# EAGLE design Rapid_Prototype_Schematicv2 (EAGLE 9.6.2)

## Sheet 1 of 4
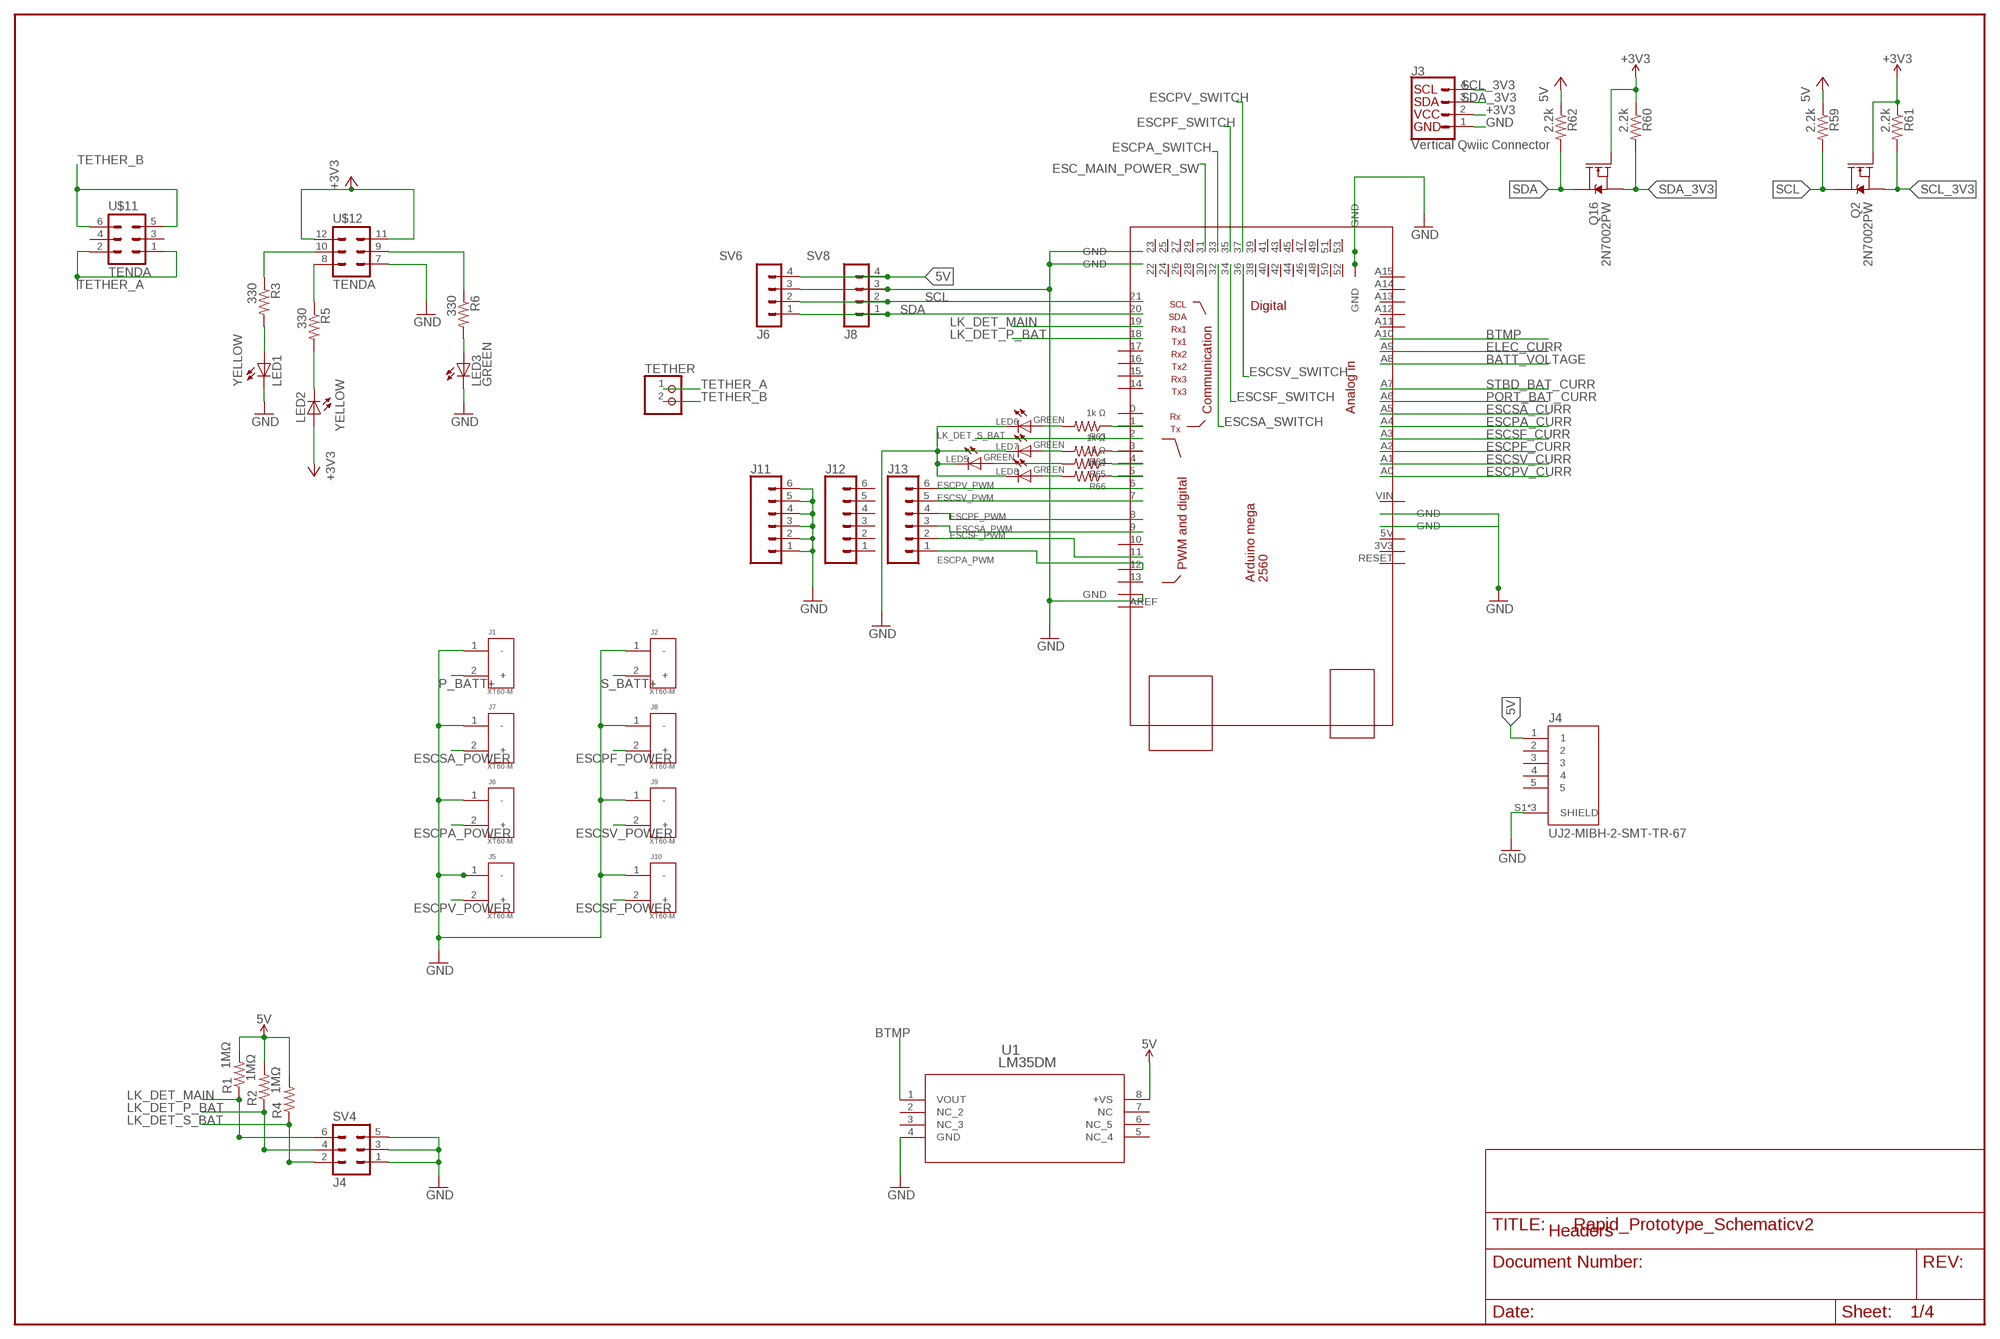
[diagram p0: schematic, sheet 1]

### Parts
$2_3_$_2020-06-04_21-52-10  MEGA_DEVICE  [MEGAOUTLINE]
J1  XT60-M  [AMASS_XT60-M]
J2  XT60-M  [AMASS_XT60-M]
J3  Vertical Qwiic Connector  QWIIC_CONNECTOR  [JST04_1MM_VERT]
J4  UJ2-MIBH-2-SMT-TR-67  [CUI_UJ2-MIBH-2-SMT-TR-67]
J5  XT60-M  [AMASS_XT60-M]
J6  XT60-M  [AMASS_XT60-M]
J7  XT60-M  [AMASS_XT60-M]
J8  XT60-M  [AMASS_XT60-M]
J9  XT60-M  [AMASS_XT60-M]
J10  XT60-M  [AMASS_XT60-M]
J11  CONN_06SILK_FEMALE_PTH  [1X06]
J12  CONN_06SILK_FEMALE_PTH  [1X06]
J13  CONN_06SILK_FEMALE_PTH  [1X06]
LED1  YELLOW  LEDCHIPLED_0805  [CHIPLED_0805]
LED2  YELLOW  LEDCHIPLED_0805  [CHIPLED_0805]
LED3  GREEN  LEDCHIPLED_0805  [CHIPLED_0805]
LED5  GREEN  LEDCHIPLED_0805  [CHIPLED_0805]
LED6  GREEN  LEDCHIPLED_0805  [CHIPLED_0805]
LED7  GREEN  LEDCHIPLED_0805  [CHIPLED_0805]
LED8  GREEN  LEDCHIPLED_0805  [CHIPLED_0805]
Q2  2N7002PW  MOSFET-NCH-2N7002PW  [SOT323]
Q16  2N7002PW  MOSFET-NCH-2N7002PW  [SOT323]
R1  1MΩ  R-US_M0805  [M0805]
R2  1MΩ  R-US_M0805  [M0805]
R3  330  R-US_R0805  [R0805]
R4  1MΩ  R-US_M0805  [M0805]
R5  330  R-US_R0805  [R0805]
R6  330  R-US_R0805  [R0805]
R59  2.2k  R-US_R0805  [R0805]
R60  2.2k  R-US_R0805  [R0805]
R61  2.2k  R-US_R0805  [R0805]
R62  2.2k  R-US_R0805  [R0805]
R63  1k Ω  R-US_M0805  [M0805]
R64  1k Ω  R-US_M0805  [M0805]
R65  1k Ω  R-US_M0805  [M0805]
R66  1k Ω  R-US_M0805  [M0805]
SV4  J4  MA03-2  [MA03-2]
SV6  J6  MA04-1  [MA04-1]
SV8  J8  MA04-1  [MA04-1]
TETHER  PINHD-1X2  [1X02]
U1  LM35DM  [M08A]
U$1  TENDA  [TENDA]

### Nets
3.3V: Q2.1(G) Q16.1(G) R60.1 R61.1 ; supply symbol labelled +3V3
5V: J4.1 R1.2 R2.2 R4.2 SV6.4 SV8.4 U1.8(+VS) ; also sheet 2,3
+3V3: J3.2 LED2.A U$1.11 U$1.12 ; also sheet 3
+5V: R59.1 R62.1 ; supply symbol labelled 5V
BATT_VOLTAGE: $2_3_$_2020-06-04_21-52-10.A8 ; also sheet 3
BTMP: $2_3_$_2020-06-04_21-52-10.A10 U1.1(VOUT)
ELEC_CURR: $2_3_$_2020-06-04_21-52-10.A9 ; also sheet 2
ESC_MAIN_POWER_SW: $2_3_$_2020-06-04_21-52-10.31 ; also sheet 4
ESCPA_CURR: $2_3_$_2020-06-04_21-52-10.A4 ; also sheet 2
ESCPA_POWER: J6.2(+) ; also sheet 4
ESCPA_PWM: $2_3_$_2020-06-04_21-52-10.12 J13.1
ESCPA_SWITCH: $2_3_$_2020-06-04_21-52-10.33 ; also sheet 4
ESCPF_CURR: $2_3_$_2020-06-04_21-52-10.A2 ; also sheet 2
ESCPF_POWER: J8.2(+) ; also sheet 4
ESCPF_PWM: $2_3_$_2020-06-04_21-52-10.8 J13.4
ESCPF_SWITCH: $2_3_$_2020-06-04_21-52-10.35 ; also sheet 4
ESCPV_CURR: $2_3_$_2020-06-04_21-52-10.A0 ; also sheet 2
ESCPV_POWER: J5.2(+) ; also sheet 4
ESCPV_PWM: $2_3_$_2020-06-04_21-52-10.6 J13.6
ESCPV_SWITCH: $2_3_$_2020-06-04_21-52-10.37 ; also sheet 4
ESCSA_CURR: $2_3_$_2020-06-04_21-52-10.A5 ; also sheet 2
ESCSA_POWER: J7.2(+) ; also sheet 4
ESCSA_PWM: $2_3_$_2020-06-04_21-52-10.9 J13.3
ESCSA_SWITCH: $2_3_$_2020-06-04_21-52-10.32 ; also sheet 4
ESCSF_CURR: $2_3_$_2020-06-04_21-52-10.A3 ; also sheet 2
ESCSF_POWER: J10.2(+) ; also sheet 4
ESCSF_PWM: $2_3_$_2020-06-04_21-52-10.11 J13.2
ESCSF_SWITCH: $2_3_$_2020-06-04_21-52-10.34 ; also sheet 4
ESCSV_CURR: $2_3_$_2020-06-04_21-52-10.A1 ; also sheet 2
ESCSV_POWER: J9.2(+) ; also sheet 4
ESCSV_PWM: $2_3_$_2020-06-04_21-52-10.7 J13.5
ESCSV_SWITCH: $2_3_$_2020-06-04_21-52-10.36 ; also sheet 4
GND: $2_3_$_2020-06-04_21-52-10.GND@1(GND) $2_3_$_2020-06-04_21-52-10.GND@2(GND) $2_3_$_2020-06-04_21-52-10.GND@3(GND) $2_3_$_2020-06-04_21-52-10.GND@4(GND) $2_3_$_2020-06-04_21-52-10.GND@5(GND) $2_3_$_2020-06-04_21-52-10.GND@6(GND) $2_3_$_2020-06-04_21-52-10.GND@7(GND) J1.1(-) J2.1(-) J3.1 J4.S1(SHIELD) J4.S2(SHIELD) J4.S3(SHIELD) J5.1(-) J6.1(-) J7.1(-) J8.1(-) J9.1(-) J10.1(-) J11.1 J11.2 J11.3 J11.4 J11.5 J11.6 LED1.C LED3.C LED5.C LED6.C LED7.C LED8.C SV4.1 SV4.3 SV4.5 SV6.3 SV8.3 U1.4(GND) U$1.7 ; also sheet 2,3,4
LK_DET_MAIN: $2_3_$_2020-06-04_21-52-10.19 R1.1 SV4.6
LK_DET_P_BAT: $2_3_$_2020-06-04_21-52-10.18 R2.1 SV4.4
LK_DET_S_BAT: $2_3_$_2020-06-04_21-52-10.2 R4.1 SV4.2
N$8: $2_3_$_2020-06-04_21-52-10.3 R64.1
N$14: $2_3_$_2020-06-04_21-52-10.4 R65.1
N$28: $2_3_$_2020-06-04_21-52-10.5 R66.1
N$40: $2_3_$_2020-06-04_21-52-10.1 R63.1
N$41: LED6.A R63.2
N$42: LED7.A R64.2
N$45: LED5.A R65.2
N$46: LED8.A R66.2
N$53: R3.1 U$1.10
N$54: LED2.C R5.2
N$55: R5.1 U$1.8
N$56: LED1.A R3.2
N$57: R6.1 U$1.9
N$58: LED3.A R6.2
P_BATT+: J1.2(+) ; also sheet 3
PORT_BAT_CURR: $2_3_$_2020-06-04_21-52-10.A6 ; also sheet 3
S_BATT+: J2.2(+) ; also sheet 3
SCL: $2_3_$_2020-06-04_21-52-10.21 Q2.3(D) R59.2 SV6.2 SV8.2
SCL_3V3: J3.4 Q2.2(S) R61.2
SDA: $2_3_$_2020-06-04_21-52-10.20 Q16.3(D) R62.2 SV6.1 SV8.1
SDA_3V3: J3.3 Q16.2(S) R60.2
STBD_BAT_CURR: $2_3_$_2020-06-04_21-52-10.A7 ; also sheet 3
TETHER_A: TETHER.1 U$1.1 U$1.2 ; also sheet 3
TETHER_B: TETHER.2 U$1.5 U$1.6 ; also sheet 3
Unconnected: $2_3_$_2020-06-04_21-52-10.0 $2_3_$_2020-06-04_21-52-10.3V3 $2_3_$_2020-06-04_21-52-10.5V $2_3_$_2020-06-04_21-52-10.10 $2_3_$_2020-06-04_21-52-10.13 $2_3_$_2020-06-04_21-52-10.14 $2_3_$_2020-06-04_21-52-10.15 $2_3_$_2020-06-04_21-52-10.16 $2_3_$_2020-06-04_21-52-10.17 $2_3_$_2020-06-04_21-52-10.22 $2_3_$_2020-06-04_21-52-10.23 $2_3_$_2020-06-04_21-52-10.24 $2_3_$_2020-06-04_21-52-10.25 $2_3_$_2020-06-04_21-52-10.26 $2_3_$_2020-06-04_21-52-10.27 $2_3_$_2020-06-04_21-52-10.28 $2_3_$_2020-06-04_21-52-10.29 $2_3_$_2020-06-04_21-52-10.30 $2_3_$_2020-06-04_21-52-10.38 $2_3_$_2020-06-04_21-52-10.39 $2_3_$_2020-06-04_21-52-10.40 $2_3_$_2020-06-04_21-52-10.41 $2_3_$_2020-06-04_21-52-10.42 $2_3_$_2020-06-04_21-52-10.43 $2_3_$_2020-06-04_21-52-10.44 $2_3_$_2020-06-04_21-52-10.45 $2_3_$_2020-06-04_21-52-10.46 $2_3_$_2020-06-04_21-52-10.47 $2_3_$_2020-06-04_21-52-10.48 $2_3_$_2020-06-04_21-52-10.49 $2_3_$_2020-06-04_21-52-10.50 $2_3_$_2020-06-04_21-52-10.51 $2_3_$_2020-06-04_21-52-10.52 $2_3_$_2020-06-04_21-52-10.53 $2_3_$_2020-06-04_21-52-10.A11 $2_3_$_2020-06-04_21-52-10.A12 $2_3_$_2020-06-04_21-52-10.A13 $2_3_$_2020-06-04_21-52-10.A14 $2_3_$_2020-06-04_21-52-10.A15 $2_3_$_2020-06-04_21-52-10.AREF $2_3_$_2020-06-04_21-52-10.RESET $2_3_$_2020-06-04_21-52-10.VIN J4.2 J4.3 J4.4 J4.5 J12.1 J12.2 J12.3 J12.4 J12.5 J12.6 U1.2(NC_2) U1.3(NC_3) U1.5(NC_4) U1.6(NC_5) U1.7(NC) U$1.3 U$1.4

### Notes on the sheet
- Headers

## Sheet 2 of 4
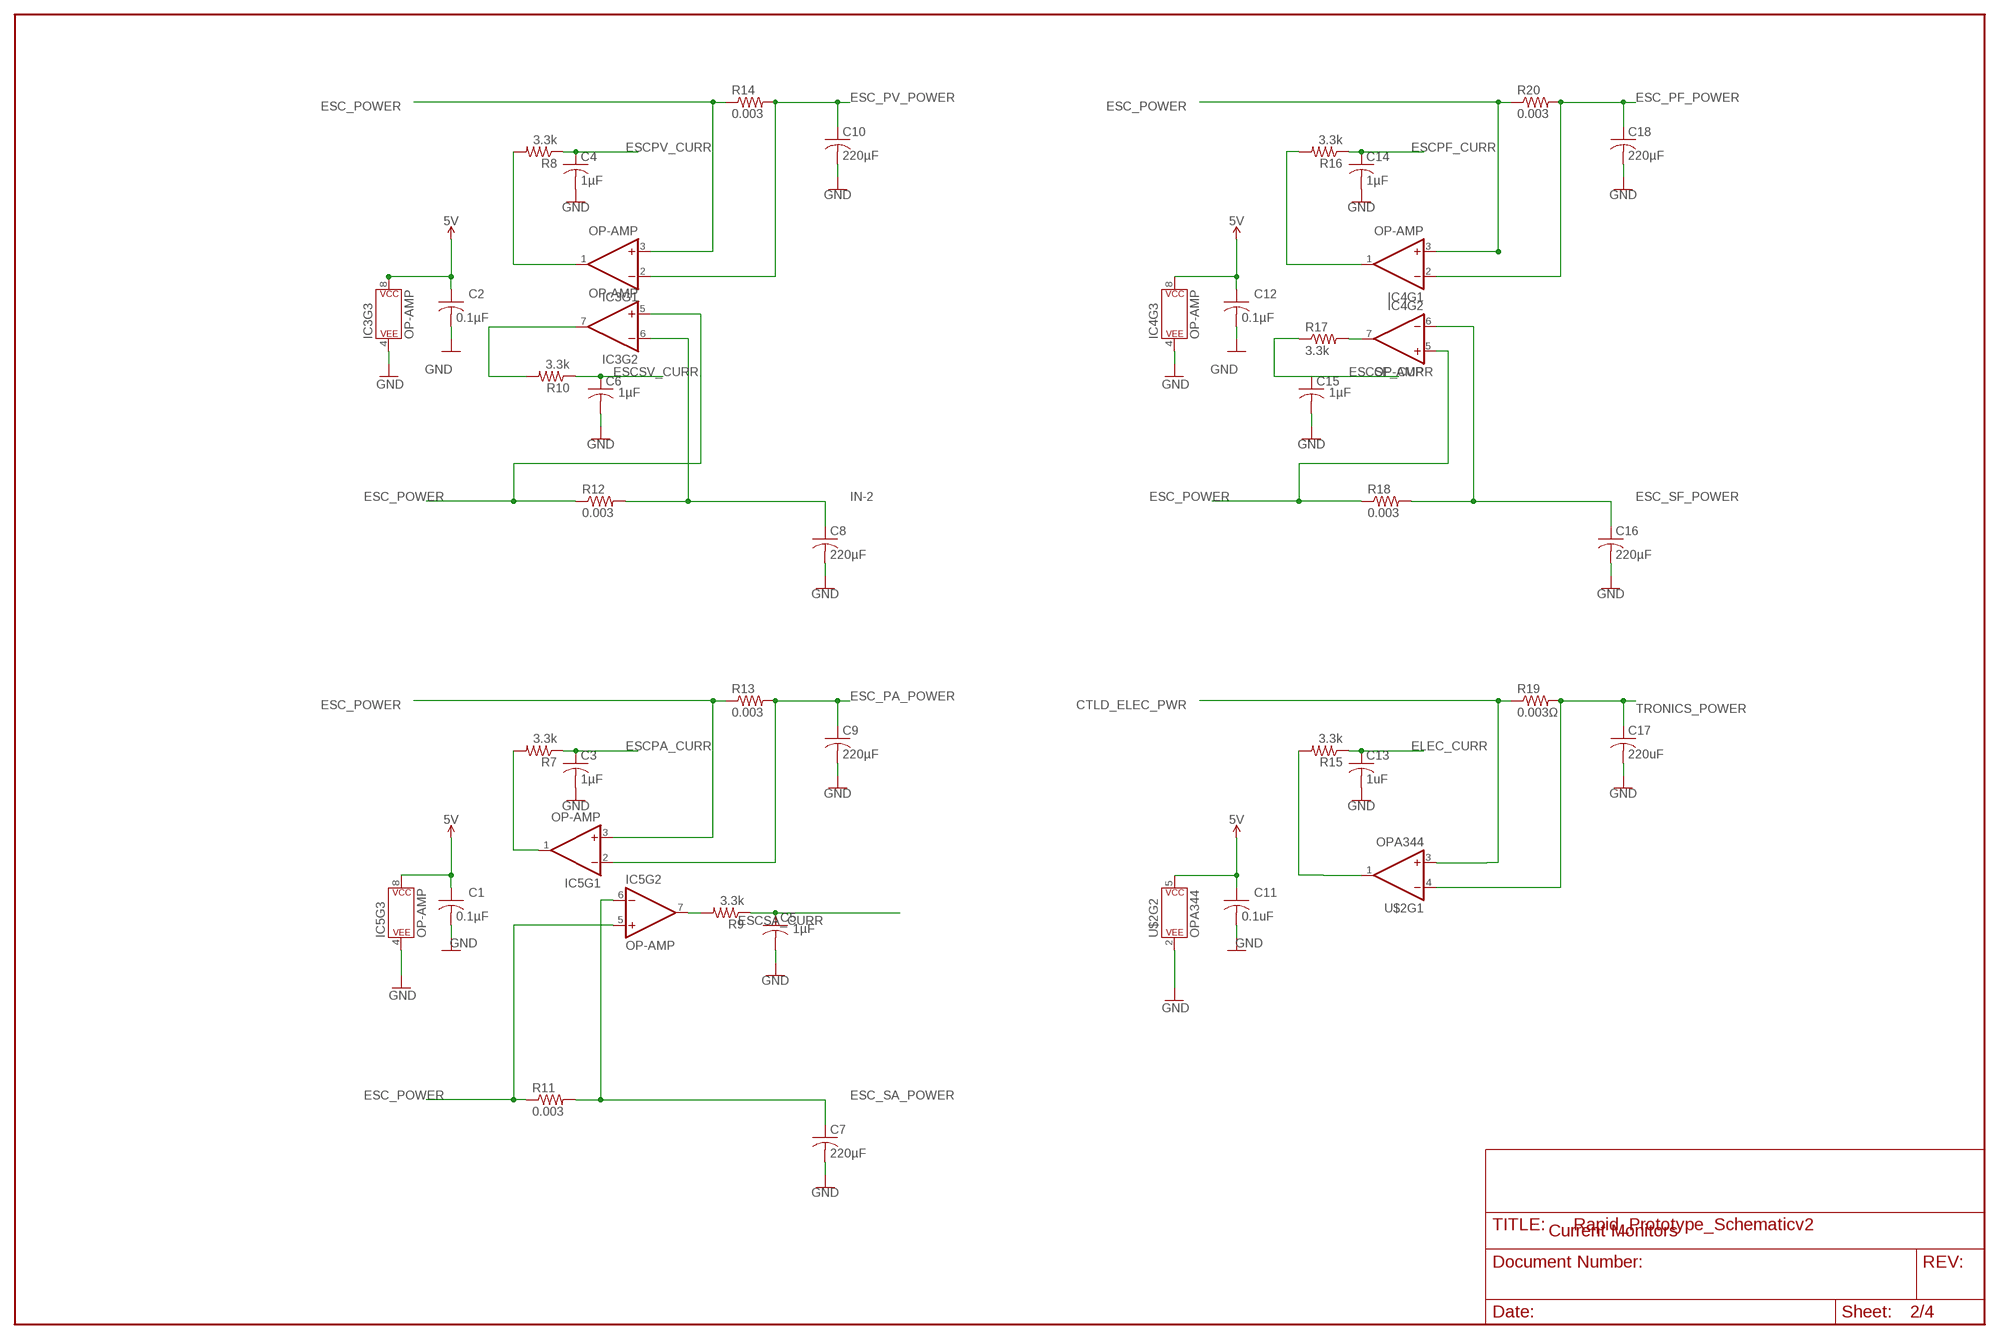
[diagram p1: schematic, sheet 2]

### Parts
C1  0.1µF  C-USC0603  [C0603]
C2  0.1µF  C-USC0603  [C0603]
C3  1µF  C-USC0603  [C0603]
C4  1µF  C-USC0603  [C0603]
C5  1µF  C-USC0603  [C0603]
C6  1µF  C-USC0603  [C0603]
C7  220µF  ADAFRUIT_C-US3.5MMCAP  [3.5MMCAP]
C8  220µF  ADAFRUIT_C-US3.5MMCAP  [3.5MMCAP]
C9  220µF  ADAFRUIT_C-US3.5MMCAP  [3.5MMCAP]
C10  220µF  ADAFRUIT_C-US3.5MMCAP  [3.5MMCAP]
C11  0.1uF  C-USC0603  [C0603]
C12  0.1µF  C-USC0603  [C0603]
C13  1uF  C-USC0805  [C0805]
C14  1µF  C-USC0603  [C0603]
C15  1µF  C-USC0603  [C0603]
C16  220µF  ADAFRUIT_C-US3.5MMCAP  [3.5MMCAP]
C17  220uF  ADAFRUIT_C-US3.5MMCAP  [3.5MMCAP]
C18  220µF  ADAFRUIT_C-US3.5MMCAP  [3.5MMCAP]
IC3  OP-AMP  OPAMP-DUALDIP  [DIP08]
IC4  OP-AMP  OPAMP-DUALDIP  [DIP08]
IC5  OP-AMP  OPAMP-DUALDIP  [DIP08]
R7  3.3k  R-US_R0603  [R0603]
R8  3.3k  R-US_R0603  [R0603]
R9  3.3k  R-US_R0603  [R0603]
R10  3.3k  R-US_R0603  [R0603]
R11  0.003  R-US_R1206  [R1206]
R12  0.003  R-US_R1206  [R1206]
R13  0.003  R-US_R1206  [R1206]
R14  0.003  R-US_R1206  [R1206]
R15  3.3k  R-US_R0603  [R0603]
R16  3.3k  R-US_R0603  [R0603]
R17  3.3k  R-US_R0603  [R0603]
R18  0.003  R-US_R1206  [R1206]
R19  0.003Ω  R-US_R1206  [R1206]
R20  0.003  R-US_R1206  [R1206]
U$2  OPA344  [SOT23-5]

### Nets
5V: C1.1 C2.1 C11.1 C12.1 IC3.8(P$V+) IC4.8(P$V+) IC5.8(P$V+) U$2.5(P$V+) ; also sheet 1,3
CTLD_ELEC_PWR: R19.1 U$2.3(+IN) ; also sheet 3
ELEC_CURR: C13.1 R15.1 ; also sheet 1
ESC_PA_POWER: C9.1 IC5.2(-IN) R13.2 ; also sheet 4
ESC_PF_POWER: C18.1 IC4.2(-IN) R20.2 ; also sheet 4
ESC_POWER: IC3.3(+IN) IC3.5(+IN) IC4.3(+IN) IC4.5(+IN) IC5.3(+IN) IC5.5(+IN) R11.1 R12.1 R13.1 R14.1 R18.1 R20.1 ; also sheet 4
ESC_PV_POWER: C10.1 IC3.2(-IN) R14.2 ; also sheet 4
ESC_SA_POWER: C7.1 IC5.6(-IN) R11.2 ; also sheet 4
ESC_SF_POWER: C16.1 IC4.6(-IN) R18.2 ; also sheet 4
ESCPA_CURR: C3.1 R7.1 ; also sheet 1
ESCPF_CURR: C14.1 R16.1 ; also sheet 1
ESCPV_CURR: C4.1 R8.1 ; also sheet 1
ESCSA_CURR: C5.1 R9.1 ; also sheet 1
ESCSF_CURR: C15.1 R17.1 ; also sheet 1
ESCSV_CURR: C6.1 R10.1 ; also sheet 1
GND: C1.2 C2.2 C3.2 C4.2 C5.2 C6.2 C7.2 C8.2 C9.2 C10.2 C11.2 C12.2 C13.2 C14.2 C15.2 C16.2 C17.2 C18.2 IC3.4(P$V-) IC4.4(P$V-) IC5.4(P$V-) U$2.2(P$V-) ; also sheet 1,3,4
IN-2: C8.1 IC3.6(-IN) R12.2
N$2: IC4.1(OUT) R16.2
N$7: IC4.7(OUT) R17.2
N$9: IC5.1(OUT) R7.2
N$11: IC5.7(OUT) R9.2
N$36: R15.2 U$2.1(OUT)
O: IC3.1(OUT) R8.2
O2: IC3.7(OUT) R10.2
TRONICS_POWER: C17.1 R19.2 U$2.4(-IN) ; also sheet 3

### Notes on the sheet
- Current Monitors

## Sheet 3 of 4
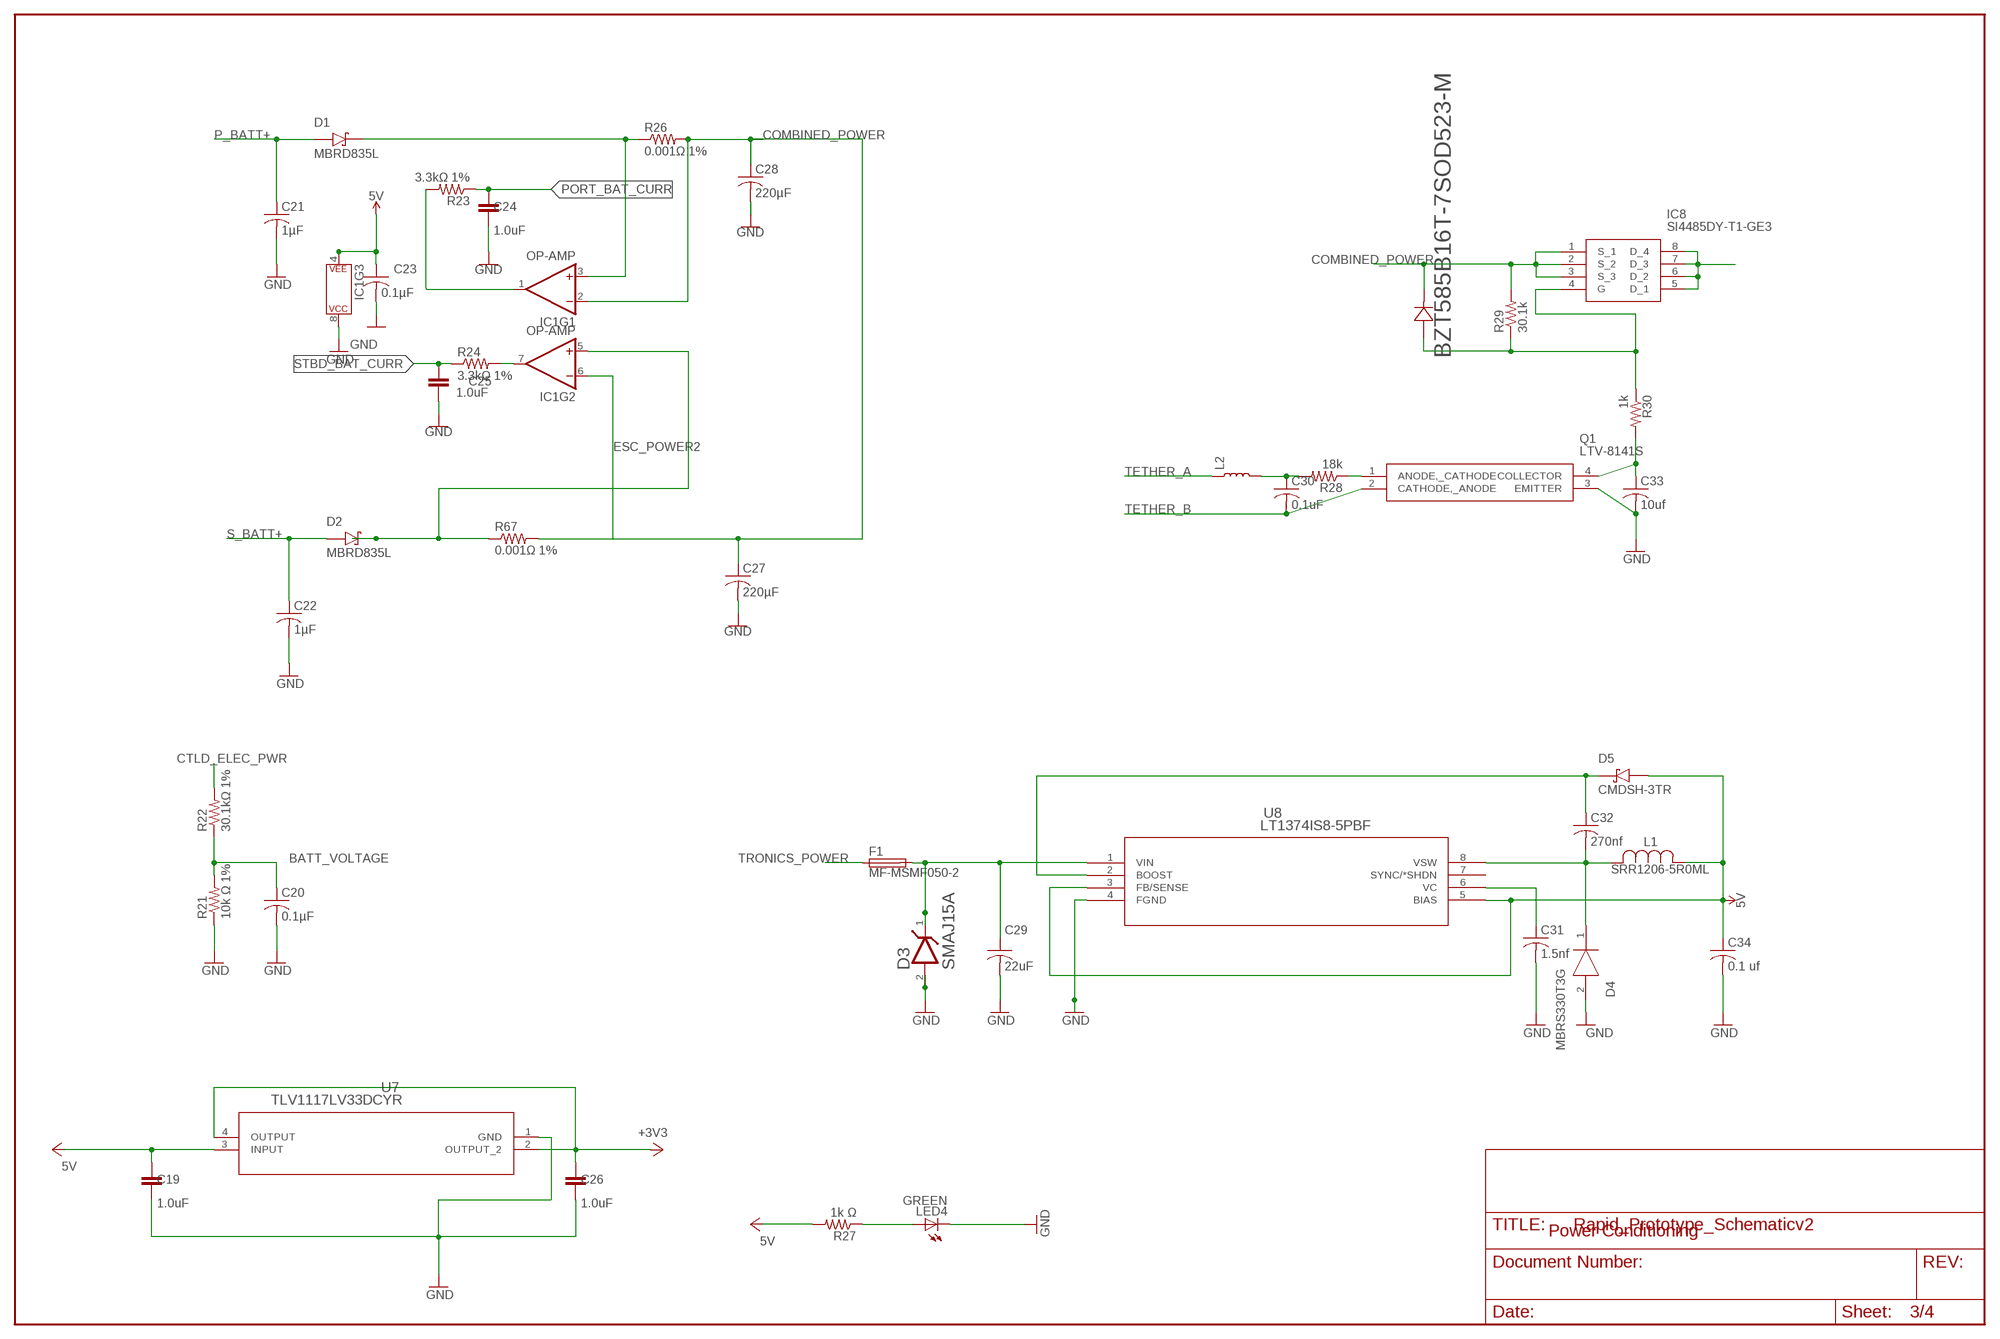
[diagram p2: schematic, sheet 3]

### Parts
C19  1.0uF  1.0UF-0603-16V-10%-X7R  [0603]
C20  0.1µF  C-USC0603  [C0603]
C21  1µF  C-USC0603  [C0603]
C22  1µF  C-USC0603  [C0603]
C23  0.1µF  C-USC0603  [C0603]
C24  1.0uF  1.0UF-0603-16V-10%-X7R  [0603]
C25  1.0uF  1.0UF-0603-16V-10%-X7R  [0603]
C26  1.0uF  1.0UF-0603-16V-10%-X7R  [0603]
C27  220µF  ADAFRUIT_C-US3.5MMCAP  [3.5MMCAP]
C28  220µF  ADAFRUIT_C-US3.5MMCAP  [3.5MMCAP]
C29  22uF  C-USC1206  [C1206]
C30  0.1uF  C-USC0603  [C0603]
C31  1.5nf  C-USC1206  [C1206]
C32  270nf  C-USC0603  [C0603]
C33  10uf  C-USC0603  [C0603]
C34  0.1 uf  C-USC0603  [C0603]
CR1  BZT585B16T-7SOD523-M  [SOD523-M]
D1  MBRD835L  [DPAK229P990X238-3N]
D2  MBRD835L  [DPAK229P990X238-3N]
D3  BOURNS-INC.---SMAJ15A_BOURNS_INC._SMAJ15ABOURNS_INC._SMAJ15A_0_0  [BOURNS-INC.---SMAJ15A_BOURNS_INC._SMAJ15A_0]
D4  MBRS330T3G  [DIOM7958X256N]
D5  CMDSH-3TR  [SOD2512X110N]
F1  MF-MSMF050-2  [FUSM1812X02]
IC1  OP-AMP  OPAMP-DUALDIP  [DIP08]
IC8  SI4485DY-T1-GE3  [SOIC127P600X175-8N]
L1  SRR1206-5R0ML  [IND_BOURNS_SRR1240]
L2  INDUCTOR  [XFL4020]
LED4  GREEN  LEDCHIPLED_0805  [CHIPLED_0805]
Q1  LTV-8141S  [SOP254P1016X460-4N]
R21  10k Ω 1%  R-US_M0805  [M0805]
R22  30.1kΩ 1%  R-US_M0805  [M0805]
R23  3.3kΩ 1%  R-US_R0603  [R0603]
R24  3.3kΩ 1%  R-US_R0603  [R0603]
R26  0.001Ω 1%  R-US_R2512  [R2512]
R27  1k Ω  R-US_M0805  [M0805]
R28  18k  R-US_M0805  [M0805]
R29  30.1k  R-US_M0805  [M0805]
R30  1k  R-US_M0805  [M0805]
R67  0.001Ω 1%  R-US_R2512  [R2512]
U7  TLV1117LV33DCYR  [DCY4]
U8  LT1374IS8-5PBF  [SO-8_S]

### Nets
5V: C19.1 C23.1 C34.1 D5.A IC1.4(P$V-) L1.1 R27.2 U7.3(INPUT) U8.3(FB/SENSE) U8.5(BIAS) ; also sheet 1,2
+3V3: C26.1 U7.2(OUTPUT_2) U7.4(OUTPUT) ; also sheet 1
BATT_VOLTAGE: C20.1 R21.2 R22.1 ; also sheet 1
COMBINED_POWER: C27.1 C28.1 CR1.1 IC1.2(-IN) IC1.6(-IN) IC8.1(S_1) IC8.2(S_2) IC8.3(S_3) R26.2 R29.2 R67.2 ; also sheet 4
CTLD_ELEC_PWR: IC8.5(D_1) IC8.6(D_2) IC8.7(D_3) IC8.8(D_4) R22.2 ; also sheet 2
ESC_POWER1: D1.4(K) IC1.3(+IN) R26.1
ESC_POWER2: D2.4(K) IC1.5(+IN) R67.1
GND: C19.2 C20.2 C21.2 C22.2 C23.2 C24.2 C25.2 C26.2 C27.2 C28.2 C29.2 C31.2 C33.2 C34.2 D3.2(ANODE) D4.2(A) IC1.8(P$V+) LED4.C Q1.3(EMITTER) R21.1 U7.1(GND) U8.4(FGND) ; also sheet 1,2,4
N$3: C32.2 D4.1(K) L1.2 U8.8(VSW)
N$4: C31.1 U8.6(VC)
N$16: Q1.1(ANODE,_CATHODE) R28.1
N$34: IC1.1(OUT) R23.2
N$35: IC1.7(OUT) R24.2
N$37: C29.1 D3.1(CATHODE) F1.2 U8.1(VIN)
N$38: C32.1 D5.C U8.2(BOOST)
N$39: LED4.A R27.1
N$43: CR1.2 IC8.4(G) R29.1 R30.1
N$44: C33.1 Q1.4(COLLECTOR) R30.2
N$48: C30.1 L2.P$2 R28.2
P_BATT+: C21.1 D1.1(A) D1.3(A) ; also sheet 1
PORT_BAT_CURR: C24.1 R23.1 ; also sheet 1
S_BATT+: C22.1 D2.1(A) D2.3(A) ; also sheet 1
STBD_BAT_CURR: C25.1 R24.1 ; also sheet 1
TETHER_A: L2.P$1 ; also sheet 1
TETHER_B: C30.2 Q1.2(CATHODE,_ANODE) ; also sheet 1
TRONICS_POWER: F1.1 ; also sheet 2
Unconnected: U8.7(SYNC/*SHDN)

### Notes on the sheet
- Power Conditioning

## Sheet 4 of 4
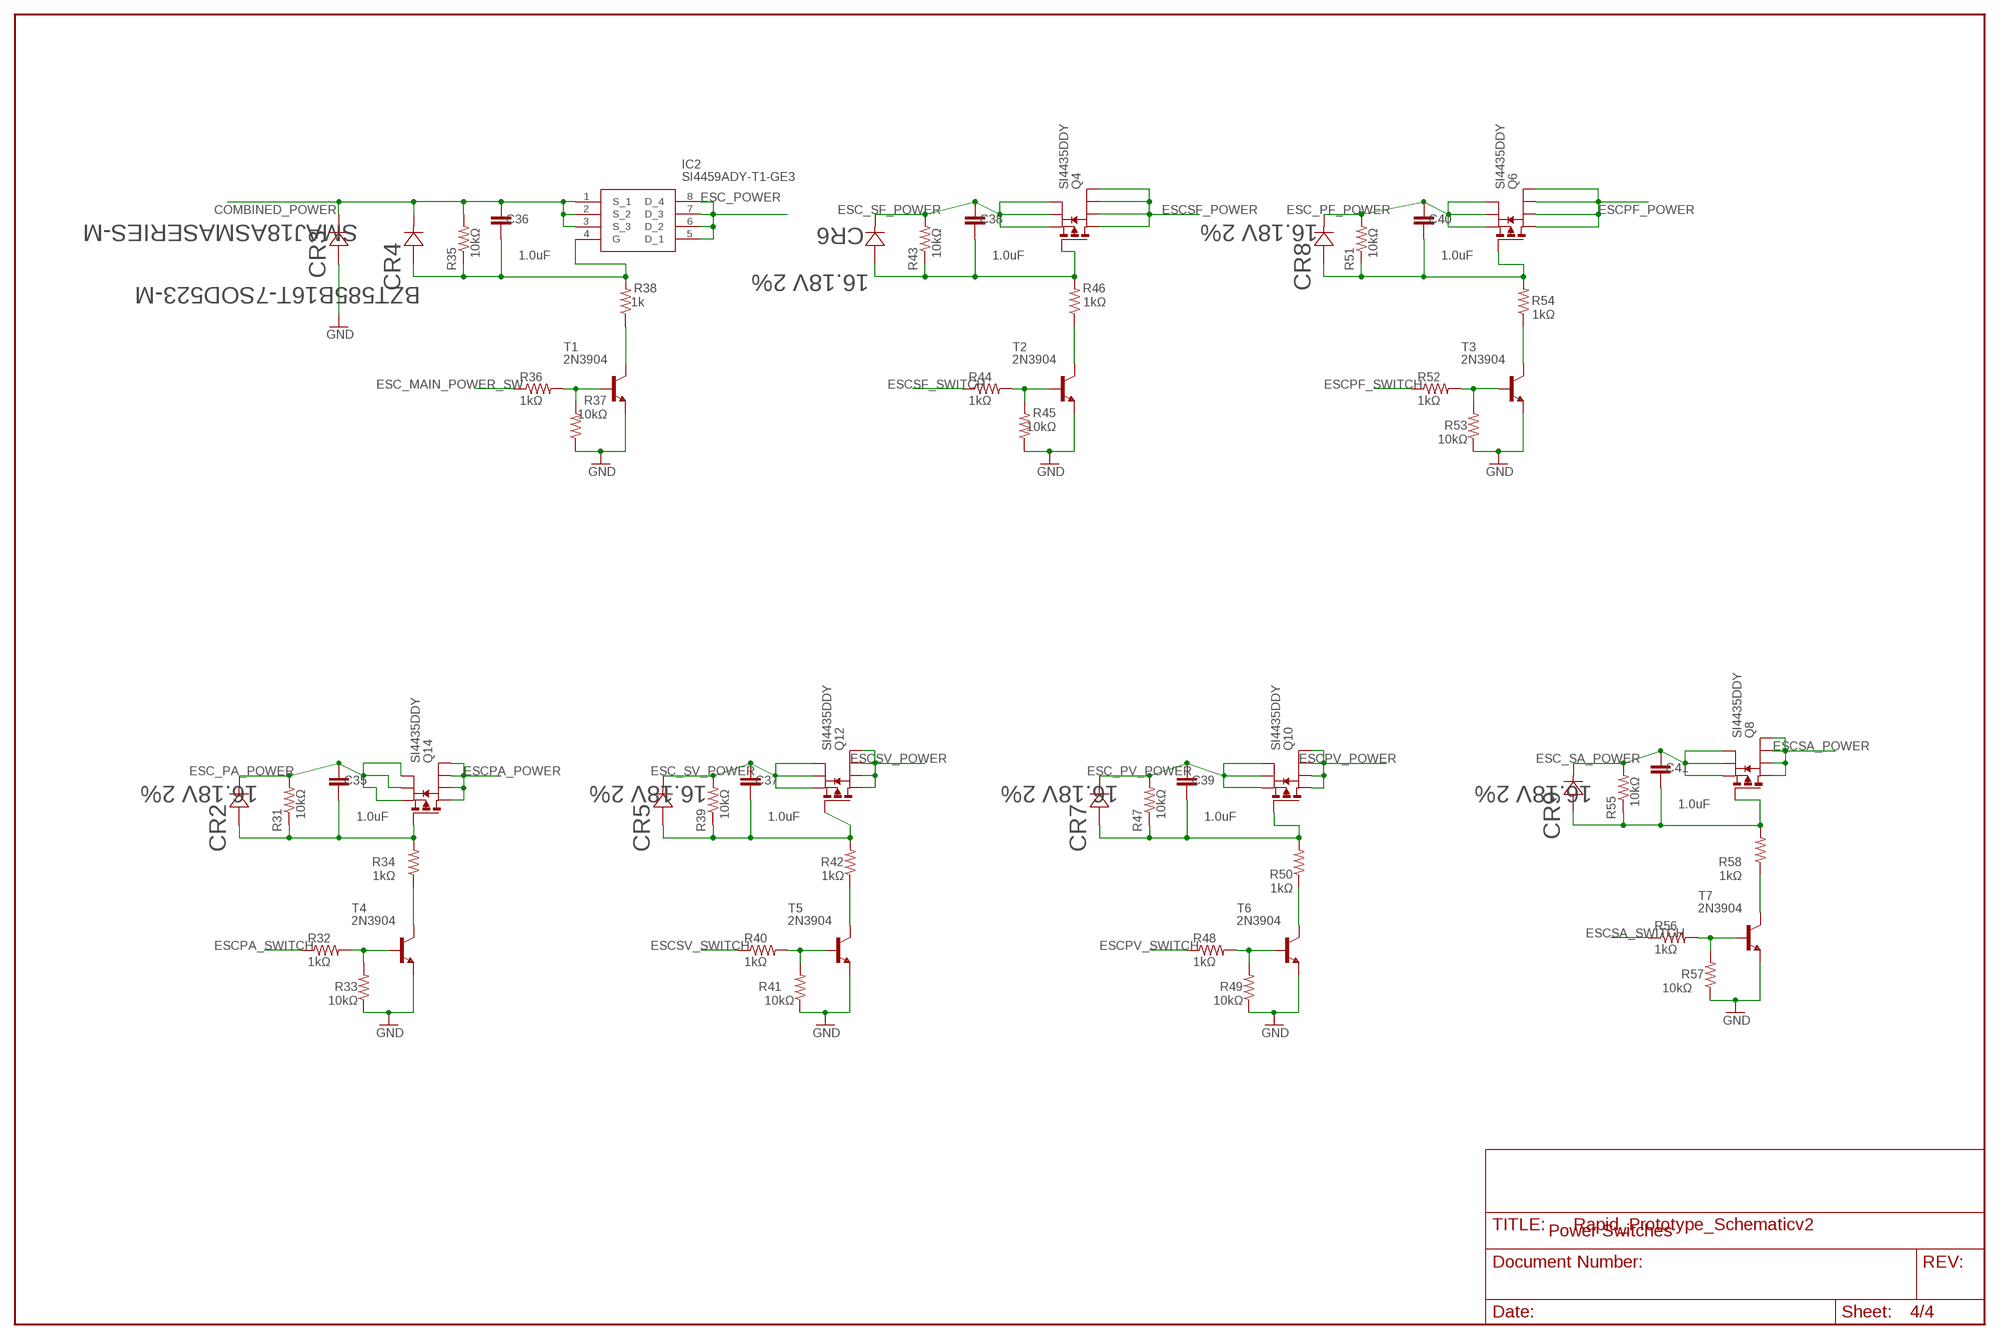
[diagram p3: schematic, sheet 4]

### Parts
C35  1.0uF  1.0UF-0603-16V-10%-X7R  [0603]
C36  1.0uF  1.0UF-0603-16V-10%-X7R  [0603]
C37  1.0uF  1.0UF-0603-16V-10%-X7R  [0603]
C38  1.0uF  1.0UF-0603-16V-10%-X7R  [0603]
C39  1.0uF  1.0UF-0603-16V-10%-X7R  [0603]
C40  1.0uF  1.0UF-0603-16V-10%-X7R  [0603]
C41  1.0uF  1.0UF-0603-16V-10%-X7R  [0603]
CR2  16.18V 2%  BZT585B16T-7SOD523-M  [SOD523-M]
CR3  SMAJ18ASMASERIES-M  [SMASERIES-M]
CR4  BZT585B16T-7SOD523-M  [SOD523-M]
CR5  16.18V 2%  BZT585B16T-7SOD523-M  [SOD523-M]
CR6  16.18V 2%  BZT585B16T-7SOD523-M  [SOD523-M]
CR7  16.18V 2%  BZT585B16T-7SOD523-M  [SOD523-M]
CR8  16.18V 2%  BZT585B16T-7SOD523-M  [SOD523-M]
CR9  16.18V 2%  BZT585B16T-7SOD523-M  [SOD523-M]
IC2  SI4459ADY-T1-GE3  [SOIC127P600X175-8N]
Q4  SI4435DDY  [SO-8]
Q6  SI4435DDY  [SO-8]
Q8  SI4435DDY  [SO-8]
Q10  SI4435DDY  [SO-8]
Q12  SI4435DDY  [SO-8]
Q14  SI4435DDY  [SO-8]
R31  10kΩ  R-US_R0603  [R0603]
R32  1kΩ  R-US_R0603  [R0603]
R33  10kΩ  R-US_R0603  [R0603]
R34  1kΩ  R-US_R0603  [R0603]
R35  10kΩ  R-US_R0603  [R0603]
R36  1kΩ  R-US_R0603  [R0603]
R37  10kΩ  R-US_R0603  [R0603]
R38  1k  R-US_R0603  [R0603]
R39  10kΩ  R-US_R0603  [R0603]
R40  1kΩ  R-US_R0603  [R0603]
R41  10kΩ  R-US_R0603  [R0603]
R42  1kΩ  R-US_R0603  [R0603]
R43  10kΩ  R-US_R0603  [R0603]
R44  1kΩ  R-US_R0603  [R0603]
R45  10kΩ  R-US_R0603  [R0603]
R46  1kΩ  R-US_R0603  [R0603]
R47  10kΩ  R-US_R0603  [R0603]
R48  1kΩ  R-US_R0603  [R0603]
R49  10kΩ  R-US_R0603  [R0603]
R50  1kΩ  R-US_R0603  [R0603]
R51  10kΩ  R-US_R0603  [R0603]
R52  1kΩ  R-US_R0603  [R0603]
R53  10kΩ  R-US_R0603  [R0603]
R54  1kΩ  R-US_R0603  [R0603]
R55  10kΩ  R-US_R0603  [R0603]
R56  1kΩ  R-US_R0603  [R0603]
R57  10kΩ  R-US_R0603  [R0603]
R58  1kΩ  R-US_R0603  [R0603]
T1  2N3904  [TO92]
T2  2N3904  [TO92]
T3  2N3904  [TO92]
T4  2N3904  [TO92]
T5  2N3904  [TO92]
T6  2N3904  [TO92]
T7  2N3904  [TO92]

### Nets
COMBINED_POWER: C36.1 CR3.1 CR4.1 IC2.1(S_1) IC2.2(S_2) IC2.3(S_3) R35.2 ; also sheet 3
ESC_MAIN_POWER_SW: R36.1 ; also sheet 1
ESC_PA_POWER: C35.1 CR2.1 Q14.1(S) Q14.2(S) Q14.3(S) R31.2 ; also sheet 2
ESC_PF_POWER: C40.1 CR8.1 Q6.1(S) Q6.2(S) Q6.3(S) R51.2 ; also sheet 2
ESC_POWER: IC2.5(D_1) IC2.6(D_2) IC2.7(D_3) IC2.8(D_4) ; also sheet 2
ESC_PV_POWER: C39.1 CR7.1 Q10.1(S) Q10.2(S) Q10.3(S) R47.2 ; also sheet 2
ESC_SA_POWER: C41.1 CR9.1 Q8.1(S) Q8.2(S) Q8.3(S) R55.2 ; also sheet 2
ESC_SF_POWER: C38.1 CR6.1 Q4.1(S) Q4.2(S) Q4.3(S) R43.2 ; also sheet 2
ESC_SV_POWER: C37.1 CR5.1 Q12.1(S) Q12.2(S) Q12.3(S) R39.2
ESCPA_POWER: Q14.5(D) Q14.6(D) Q14.7(D) Q14.8(D) ; also sheet 1
ESCPA_SWITCH: R32.1 ; also sheet 1
ESCPF_POWER: Q6.5(D) Q6.6(D) Q6.7(D) Q6.8(D) ; also sheet 1
ESCPF_SWITCH: R52.1 ; also sheet 1
ESCPV_POWER: Q10.5(D) Q10.6(D) Q10.7(D) Q10.8(D) ; also sheet 1
ESCPV_SWITCH: R48.1 ; also sheet 1
ESCSA_POWER: Q8.5(D) Q8.6(D) Q8.7(D) Q8.8(D) ; also sheet 1
ESCSA_SWITCH: R56.1 ; also sheet 1
ESCSF_POWER: Q4.5(D) Q4.6(D) Q4.7(D) Q4.8(D) ; also sheet 1
ESCSF_SWITCH: R44.1 ; also sheet 1
ESCSV_POWER: Q12.5(D) Q12.6(D) Q12.7(D) Q12.8(D) ; also sheet 1
ESCSV_SWITCH: R40.1 ; also sheet 1
GND: CR3.2 R33.1 R37.1 R41.1 R45.1 R49.1 R53.1 R57.1 T1.3(E) T2.3(E) T3.3(E) T4.3(E) T5.3(E) T6.3(E) T7.3(E) ; also sheet 1,2,3
N$6: C36.2 CR4.2 IC2.4(G) R35.1 R38.2
N$10: R32.2 R33.2 T4.2(B)
N$12: C40.2 CR8.2 Q6.4(G) R51.1 R54.2
N$13: C35.2 CR2.2 Q14.4(G) R31.1 R34.2
N$15: R38.1 T1.1(C)
N$17: R36.2 R37.2 T1.2(B)
N$18: R34.1 T4.1(C)
N$19: C37.2 CR5.2 Q12.4(G) R39.1 R42.2
N$20: R40.2 R41.2 T5.2(B)
N$21: R42.1 T5.1(C)
N$22: C39.2 CR7.2 Q10.4(G) R47.1 R50.2
N$23: R48.2 R49.2 T6.2(B)
N$24: R50.1 T6.1(C)
N$25: C41.2 CR9.2 Q8.4(G) R55.1 R58.2
N$26: R56.2 R57.2 T7.2(B)
N$27: R58.1 T7.1(C)
N$29: R52.2 R53.2 T3.2(B)
N$30: R54.1 T3.1(C)
N$31: C38.2 CR6.2 Q4.4(G) R43.1 R46.2
N$32: R44.2 R45.2 T2.2(B)
N$33: R46.1 T2.1(C)

### Notes on the sheet
- Power Switches

## Library data of the parts
$2_3_$_2020-06-04_21-52-10 = ArduinoMegaOutline:MEGA_DEVICE: mega card as device
C1-C6 C11-C15 C20-C23 C29-C34 = adafruit:C-US: CAPACITOR, American symbol
C7-C10 C16-C18 C27 C28 = Rapid_Prototype_Schematic:ADAFRUIT_C-US: CAPACITOR, American symbol
C19 C24-C26 C35-C41 = SparkFun-Capacitors:1.0UF: 1µF ceramic capacitors A capacitor is a passive two-terminal electrical component used to store electrical energy temporarily in an electric field.; PROD_ID: CAP-13930
CR1 CR2 CR4-CR9 = Diode1:BZT585B16T-7; MANUFACTURER_PART_NUMBER: BZT585B16T7; VENDOR: Diodes Inc
CR3 = Diode2:SMAJ18A; MANUFACTURER_PART_NUMBER: SMAJ18A; VENDOR: Littelfuse Inc
D1 D2 = MBRD835L:MBRD835L: schottky, diode, Schottky Diodes, Diodes, Discretes (diodes, transistors, thyristors ...), Semiconductors and Actives; AVAILABILITY: Unavailable; DESCRIPTION: Diode Schottky 35V 8A Surface Mount DPAK; MF: Diodes Inc.; MP: MBRD835L-T; PACKAGE: TO-252 Diodes Inc.; PRICE: None
D3 = Rapid_Prototype_Schematic:BOURNS-INC.---SMAJ15A_BOURNS_INC._SMAJ15A: 24.4V Clamp 16.4A Ipp Tvs Diode Surface Mount SMA (DO-214AC); AUTOMOTIVE: No; BREAKDOWN_VOLTAGE: 16.7V; CENTROID_NOT_SPECIFIED: No; CLAMPING_VOLTAGE: 24.4V; DATASHEET: https://www.bourns.com/docs/Product-Datasheets/SMAJ.pdf; DEVICE_CLASS_L1: Circuit Protection; DEVICE_CLASS_L2: TVS Diodes; DEVICE_CLASS_L3: unset; DIGIKEY_DESCRIPTION: DIODE TVS DIODE 15V 24.4V SMA; DIGIKEY_PART_NUMBER: SMAJ15ABCT-ND; DIRECTION: Unidirectional; FOOTPRINT_VARIANT_NAME_0: Recommended_Land_Pattern; HEIGHT: 2.29mm; LEAD_FREE: Yes; MAX_JUNCTION_TEMP: +150°C; MF: Bourns Inc.; MFG_PACKAGE_IDENT: SMA; MFG_PACKAGE_IDENT_COMPONENT_ID: c691c3592a14e60a; MFG_PACKAGE_IDENT_DATE: 0; MFG_PACKAGE_IDENT_REV: 0; MOUSER_DESCRIPTION: Bourns Smaj15a / Diode Tvs 15v 400w Uni 5% Smd Bourns; MOUSER_PART_NUMBER: 652-SMAJ15A; MPN: SMAJ15A; NUMBER_OF_CHANNELS: 1; PACKAGE: SMA; PEAK_PULSE_CURRENT: 16.4A; PEAK_PULSE_POWER: 400W; PREFIX: D; REVERSE_STANDOFF_VOLTAGE: 15V; ROHS: Yes; TEMPERATURE_RANGE_HIGH: +150°C; TEMPERATURE_RANGE_LOW: -55°C; VERIFICATION_VERSION: 0.0.0.3
D4 = MBRS330T3G:MBRS330T3G: Source: Datasheet <http://www.onsemi.com/pub/Collateral/MBRS340T3-D.PDF>; HEIGHT: 2.56mm; MANUFACTURER_NAME: ON Semiconductor; MANUFACTURER_PART_NUMBER: MBRS330T3G; MOUSER_PART_NUMBER: 863-MBRS330T3G; MOUSER_PRICE-STOCK: https://www.mouser.com/Search/Refine.aspx?Keyword=863-MBRS330T3G
D5 = CMDSH-3TR:CMDSH-3TR: CMDSH Series 30 V 100 mA Surface Mount Schottky Diode - SOD-323; AVAILABILITY: Unavailable; DESCRIPTION: Diode Schottky 30V 100mA Surface Mount SOD-323; MF: Central Semiconductor; MP: CMDSH-3 TR; PACKAGE: SOD-323 Central Semiconductor; PRICE: None
F1 = MF-MSMF050-2:MF-MSMF050-2: PTC Resettable Fuse 0.5A(hold) 1A(trip) 15V 100A 0.8W 0.15s 0.15Ohm SMD Solder Pad 1812 T/R; AVAILABILITY: Unavailable; DESCRIPTION: Polymeric PTC Resettable Fuse 15V 500mA Ih Surface Mount 1812 _4532 Metric_, Concave; MF: Bourns; MP: MF-MSMF050-2; PACKAGE: 1812 Bourns; PRICE: None
IC1 IC3-IC5 = SparkFun-IC-Amplifiers:OPAMP-DUAL: Generic op-amp footprint This component is for the standard 358 pinning of a dual op-amp From the LM358 datasheet: Pin 1: Output A Pin 2: Inverting Input A Pin 3: Non-Inverting Input A Pin 4: Gnd Pin 5: Non-Inverting Input B Pin 6: Inverting Input B Pin 7: Output B Pin 8: V+; PROD_ID: NA-XXXXX
IC2 = SI4459ADY-T1-GE3:SI4459ADY-T1-GE3: Trans MOSFET P-CH 30V 29A 8-Pin SOIC N T/R Source: Datasheet <http://www.vishay.com/docs/69979/si4459ad.pdf>; DESCRIPTION: Trans MOSFET P-CH 30V 29A 8-Pin SOIC N T/R; HEIGHT: 1.75mm; MANUFACTURER_NAME: Vishay; MANUFACTURER_PART_NUMBER: SI4459ADY-T1-GE3; MOUSER_PART_NUMBER: 781-SI4459ADY-T1-GE3; MOUSER_PRICE-STOCK: https://www.mouser.co.uk/ProductDetail/Vishay-Semiconductors/SI4459ADY-T1-GE3?qs=IRuQNBqMOcnyBuDcl66N0Q%3D%3D
IC8 = SI4485DY-T1-GE3:SI4485DY-T1-GE3: MOSFET 30V 6.0A 5.0W 42mohm @ 10V Source: Datasheet <https://www.arrow.com/en/products/si4485dy-t1-ge3/vishay>; DESCRIPTION: MOSFET 30V 6.0A 5.0W 42mohm @ 10V; HEIGHT: 1.75mm; MANUFACTURER_NAME: Vishay; MANUFACTURER_PART_NUMBER: SI4485DY-T1-GE3; MOUSER_PART_NUMBER: 781-SI4485DY-T1-GE3; MOUSER_PRICE-STOCK: https://www.mouser.co.uk/ProductDetail/Vishay-Semiconductors/SI4485DY-T1-GE3?qs=yQ4lPMPRQIrw%2Fu7lX1YS%2Fw%3D%3D
J1 J2 J5-J10 = XT60-M:XT60-M: DC supply; XT60; male; PIN:2; for cable; soldered; 60A; 500V; AVAILABILITY: Unavailable; DESCRIPTION: Plug; DC supply; XT60; male; PIN: 2; for cable; soldered; 30A; 500V; MF: AMASS; MP: XT60-M; PACKAGE: Package; PRICE: None
J3 = SparkFun-Connectors:QWIIC_CONNECTOR: SparkFun I2C Standard Qwiic Connector An SMD 1mm pitch JST connector makes it easy and quick (get it? Qwiic?) to connect I2C devices to each other. The Qwiic system <http://www.sparkfun.com/qwiic> enables fast and solderless connection between popular platforms and various sensors and actuators. We carry 200mm <https://www.sparkfun.com/products/14204>, 100mm <https://www.sparkfun.com/products/14205>, 50mm <https://www.sparkfun.com/products/14206>, and breadboard friendly <https://www.sparkfun.com/products/14207> Qwiic cables. We also offer 10 pcs strips <https://www.sparkfun.com/products/14323> the SMD connectors.; PROD_ID: CONN-14483
J4 = UJ2-MIBH-2-SMT-TR-67:UJ2-MIBH-2-SMT-TR-67; MANUFACTURER: CUI Inc; PARTREV: C; STANDARD: Manufacturer recommendations
J11-J13 = SparkFun-Connectors:CONN_06: Multi connection point. Often used as Generic Header-pin footprint for 0.1 inch spaced/style header connections On any of the 0.1 inch spaced packages, you can populate with these: Break Away Headers - Straight <https://www.sparkfun.com/products/116> (PRT-00116) Break Away Male Headers - Right Angle <https://www.sparkfun.com/products/553> (PRT-00553) Female Headers <https://www.sparkfun.com/products/115> (PRT-00115) Break Away Headers - Machine Pin <https://www.sparkfun.com/products/117> (PRT-00117) Break Away Female Headers - Swiss Machine Pin <https://www.sparkfun.com/products/743> (PRT-00743) Arduino Stackable Header - 6 Pin <https://www.sparkfun.com/products/9280> (PRT-09280) For SCREWTERMINALS and SPRING TERMINALS visit here: Screw Terimnals on SparkFun.com <https://www.sparkfun.com/search/results?term=Screw+Terminals> (5mm/3.5mm/2.54mm spacing) This device is also useful as a general connection point to wire up your design to another part of your project. Our various solder wires solder well into these plated through hole pads. Hook-Up Wire - Assortment (Stranded, 22 AWG) <https://www.sparkfun.com/products/11375> (PRT-11375) Hook-Up Wire - Assortment (Solid Core, 22 AWG) <https://www.sparkfun.com/products/11367> (PRT-11367) View the entire wire category on our website here <https://www.sparkfun.com/categories/141>; PROD_ID: CONN-08437
L1 = INDUCTOR_SRR1240:SRR1206-5R0ML; BUILT_BY: EMA_UL_Team; MANUFACTURER_PART_NUMBER: SRR1206-5R0ML; SOURCELIBRARY: Bourns_2010-01-01_IND_SRRxxxx; VENDOR: Bourns Electronics
L2 = SparkFun-Coils:INDUCTOR: Inductors Resist changes in electrical current. Basically a coil of wire. SparkFun Products: SparkFun Load Cell Amplifier - HX711 <https://www.sparkfun.com/products/13879> IOIO-OTG - V2.2 <https://www.sparkfun.com/products/13613>
LED1-LED8 = adafruit:LED: LED OSRAM: - CHIPLED LG R971, LG N971, LY N971, LG Q971, LY Q971, LO R971, LY R971 LH N974, LH R974 LS Q976, LO Q976, LY Q976 LO Q996 - Hyper CHIPLED LW Q18S LB Q993, LB Q99A, LB R99A - SideLED LS A670, LO A670, LY A670, LG A670, LP A670 LB A673, LV A673, LT A673, LW A673 LH A674 LY A675 LS A676, LA A676, LO A676, LY A676, LW A676 LS A679, LY A679, LG A679 - Hyper Micro SIDELED® LS Y876, LA Y876, LO Y876, LY Y876 LT Y87S - SmartLED LW L88C, LW L88S LB L89C, LB L89S, LG L890 LS L89K, LO L89K, LY L89K LS L896, LA L896, LO L896, LY L896 - TOPLED LS T670, LO T670, LY T670, LG T670, LP T670 LSG T670, LSP T670, LSY T670, LOP T670, LYG T670 LG T671, LOG T671, LSG T671 LB T673, LV T673, LT T673, LW T673 LH T674 LS T676, LA T676, LO T676, LY T676, LB T676, LH T676, LSB T676, LW T676 LB T67C, LV T67C, LT T67C, LS T67K, LO T67K, LY T67K, LW E67C LS E67B, LA E67B, LO E67B, LY E67B, LB E67C, LV E67C, LT E67C LW T67C LS T679, LY T679, LG T679 LS T770, LO T770, LY T770, LG T770, LP T770 LB T773, LV T773, LT T773, LW T773 LH T774 LS E675, LA E675, LY E675, LS T675 LS T776, LA T776, LO T776, LY T776, LB T776 LHGB T686 LT T68C, LB T68C - Hyper Mini TOPLED® LB M676 - Mini TOPLED Santana® LG M470 LS M47K, LO M47K, LY M47K Source: http://www.osram.convergy.de/
Q1 = LTV-8141S:LTV-8141S: Transistor Output Optocouplers Optocoupler AC input Source: Datasheet <https://media.digikey.com/pdf/Data Sheets/Lite-On PDFs/LTV-8141_8241_8441 (M,S,S_TA1).pdf>; DESCRIPTION: Transistor Output Optocouplers Optocoupler AC input; HEIGHT: 4.6mm; MANUFACTURER_NAME: Lite-On; MANUFACTURER_PART_NUMBER: LTV-8141S; MOUSER_PART_NUMBER: 859-LTV-8141S; MOUSER_PRICE-STOCK: https://www.mouser.co.uk/ProductDetail/Lite-On/LTV-8141S?qs=9PJrLaO2oWUf6ygS0H3swQ%3D%3D
Q2 Q16 = SparkFun-DiscreteSemi:MOSFET-NCH: N-channel MOSFETs Voltage controlled devices that allow control of high current outputs. SparkFun Products: SparkFun OpenScale <https://www.sparkfun.com/products/13261> SparkFun Digital Sandbox <https://www.sparkfun.com/products/12651> SparkFun Monster Moto Shield <https://www.sparkfun.com/products/10182> SparkFun MOSFET Power Controller <https://www.sparkfun.com/products/11214>; PROD_ID: TRANS-11151; VALUE: 310mA/60V/1.6Ω
Q4 Q6 Q8 Q10 Q12 Q14 = SI4435DDY:SI4435DDY; DESCRIPTION: P-Channel 30V 11.4A (Tc) 2.5W (Ta), 5W (Tc) Surface Mount 8-SO; MF: Vishay Siliconix; MP: SI4435DDY; PACKAGE: SOIC-8 Vishay Siliconix
R1-R24 R27-R66 = adafruit:R-US_: RESISTOR, American symbol
R26 R67 = rcl:R-US_: RESISTOR, American symbol; SPICEPREFIX: R
SV4 = con-lstb:MA03-2: PIN HEADER; OC_FARNELL: unknown; OC_NEWARK: unknown
SV6 SV8 = con-lstb:MA04-1: PIN HEADER; OC_FARNELL: unknown; OC_NEWARK: unknown
T1-T7 = transistor:2N3904: NPN TRANSISTOR
TETHER = pinhead:PINHD-1X2: PIN HEADER
U1 = LM35DM:LM35DM; BUILT_BY: EMA_UL_Team; MANUFACTURER_PART_NUMBER: LM35DM; VENDOR: Texas Instruments
U7 = TLV1117LV33DCYR:TLV1117LV33DCYR; BUILT_BY: EMA_UL_Team; MANUFACTURER: Texas Instruments; MANUFACTURER_PART_NUMBER: TLV1117LV33DCYR; VENDOR: Texas Instruments
U8 = LT1374IS8-5PBF:LT1374IS8-5PBF; AVAILABILITY: Unavailable; DESCRIPTION: Buck, SEPIC Switching Regulator IC Positive Fixed 5V 1 Output 4.5A _Switch_ 8-SOIC _0.154, 3.90mm Width_; MF: Linear Technology; MP: LT1374IS8-5#PBF; PACKAGE: SO-8 Linear Technology; PRICE: None
U$1 = tenda:TENDA
U$2 = SparkFun-IC-Amplifiers:OPA344: Single gate rail-to-rail output op-amp. Inputs extend 300mV past rails. Datasheet <http://www.ti.com/product/OPA344> SparkFun Products SparkFun Low Current Sensor <https://www.sparkfun.com/products/8883> (SEN-08883) SparkFun Electret Microphone Breakout <https://www.sparkfun.com/products/12758> (BOB-12758); PROD_ID: IC-08251

## Board
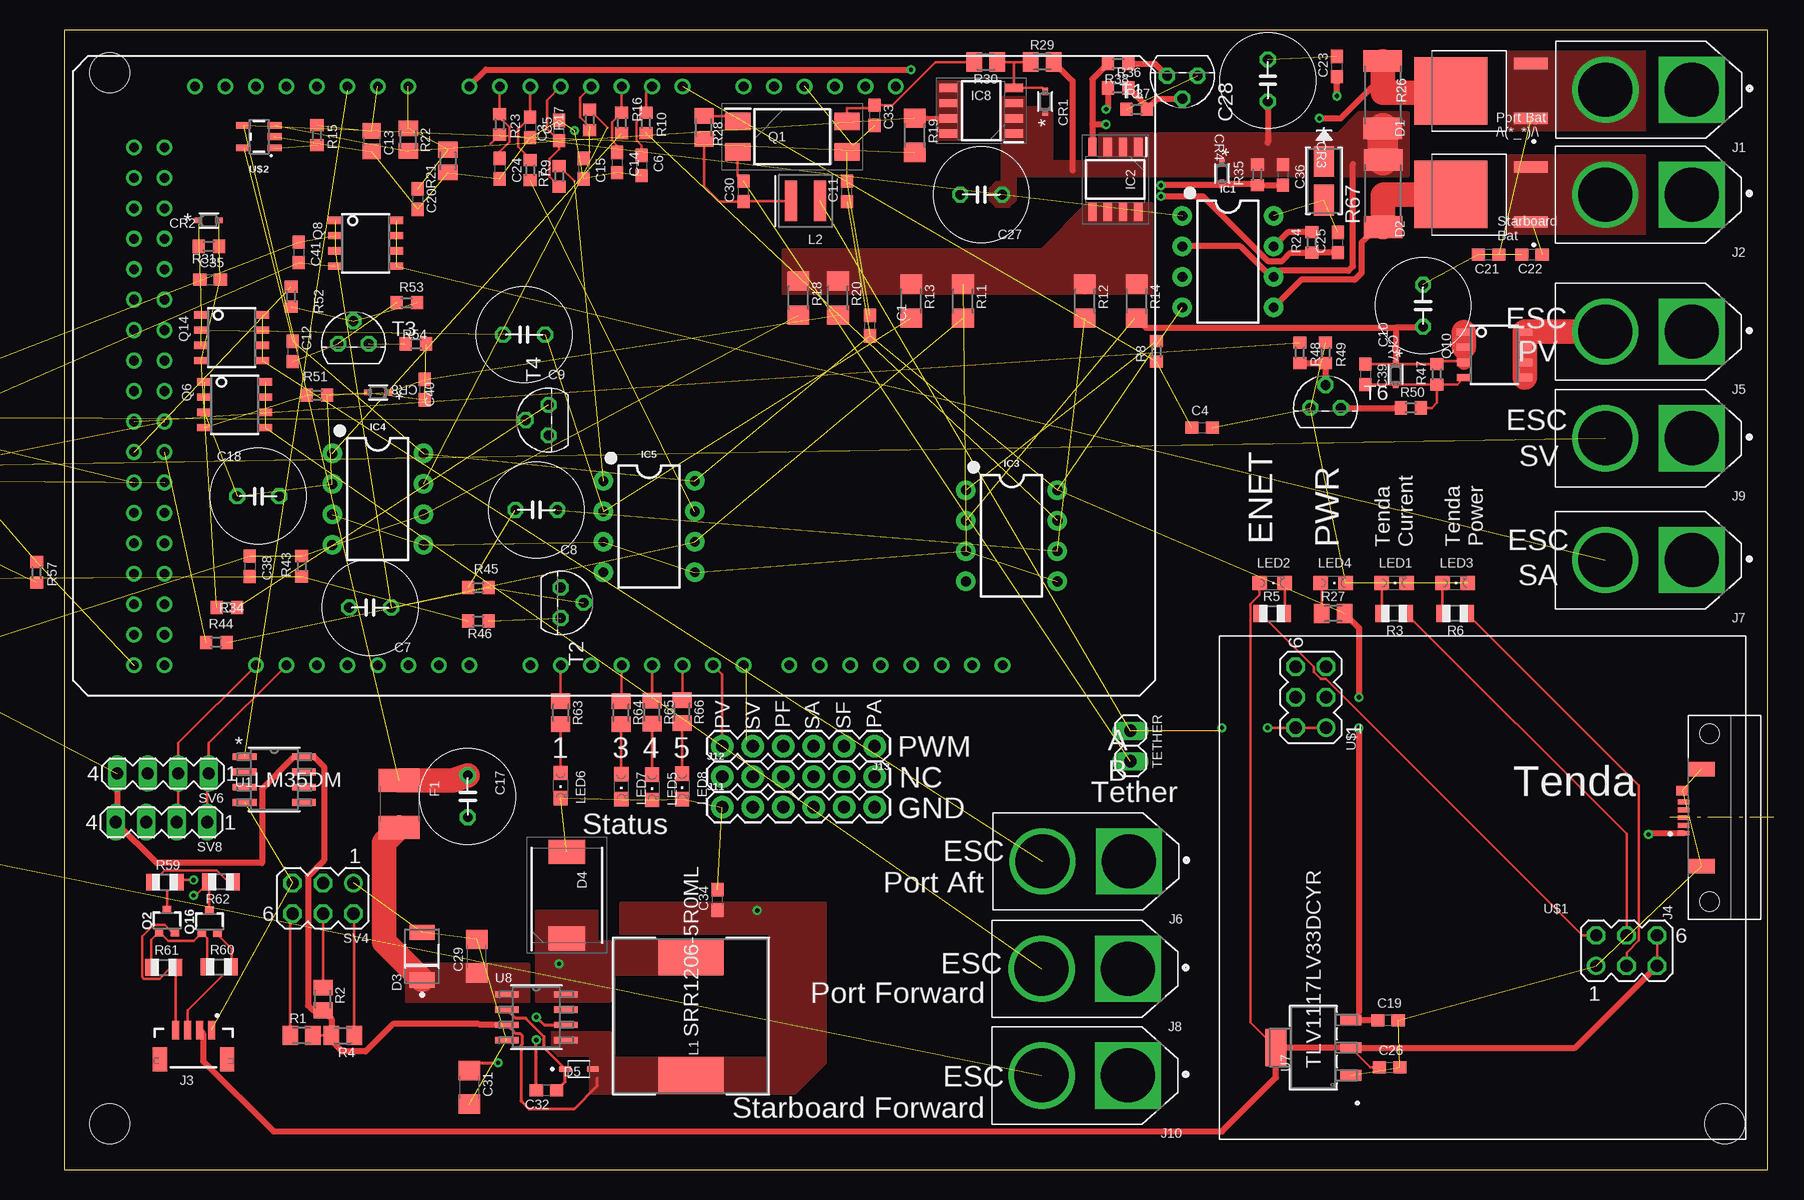
[diagram p4: board, top side]
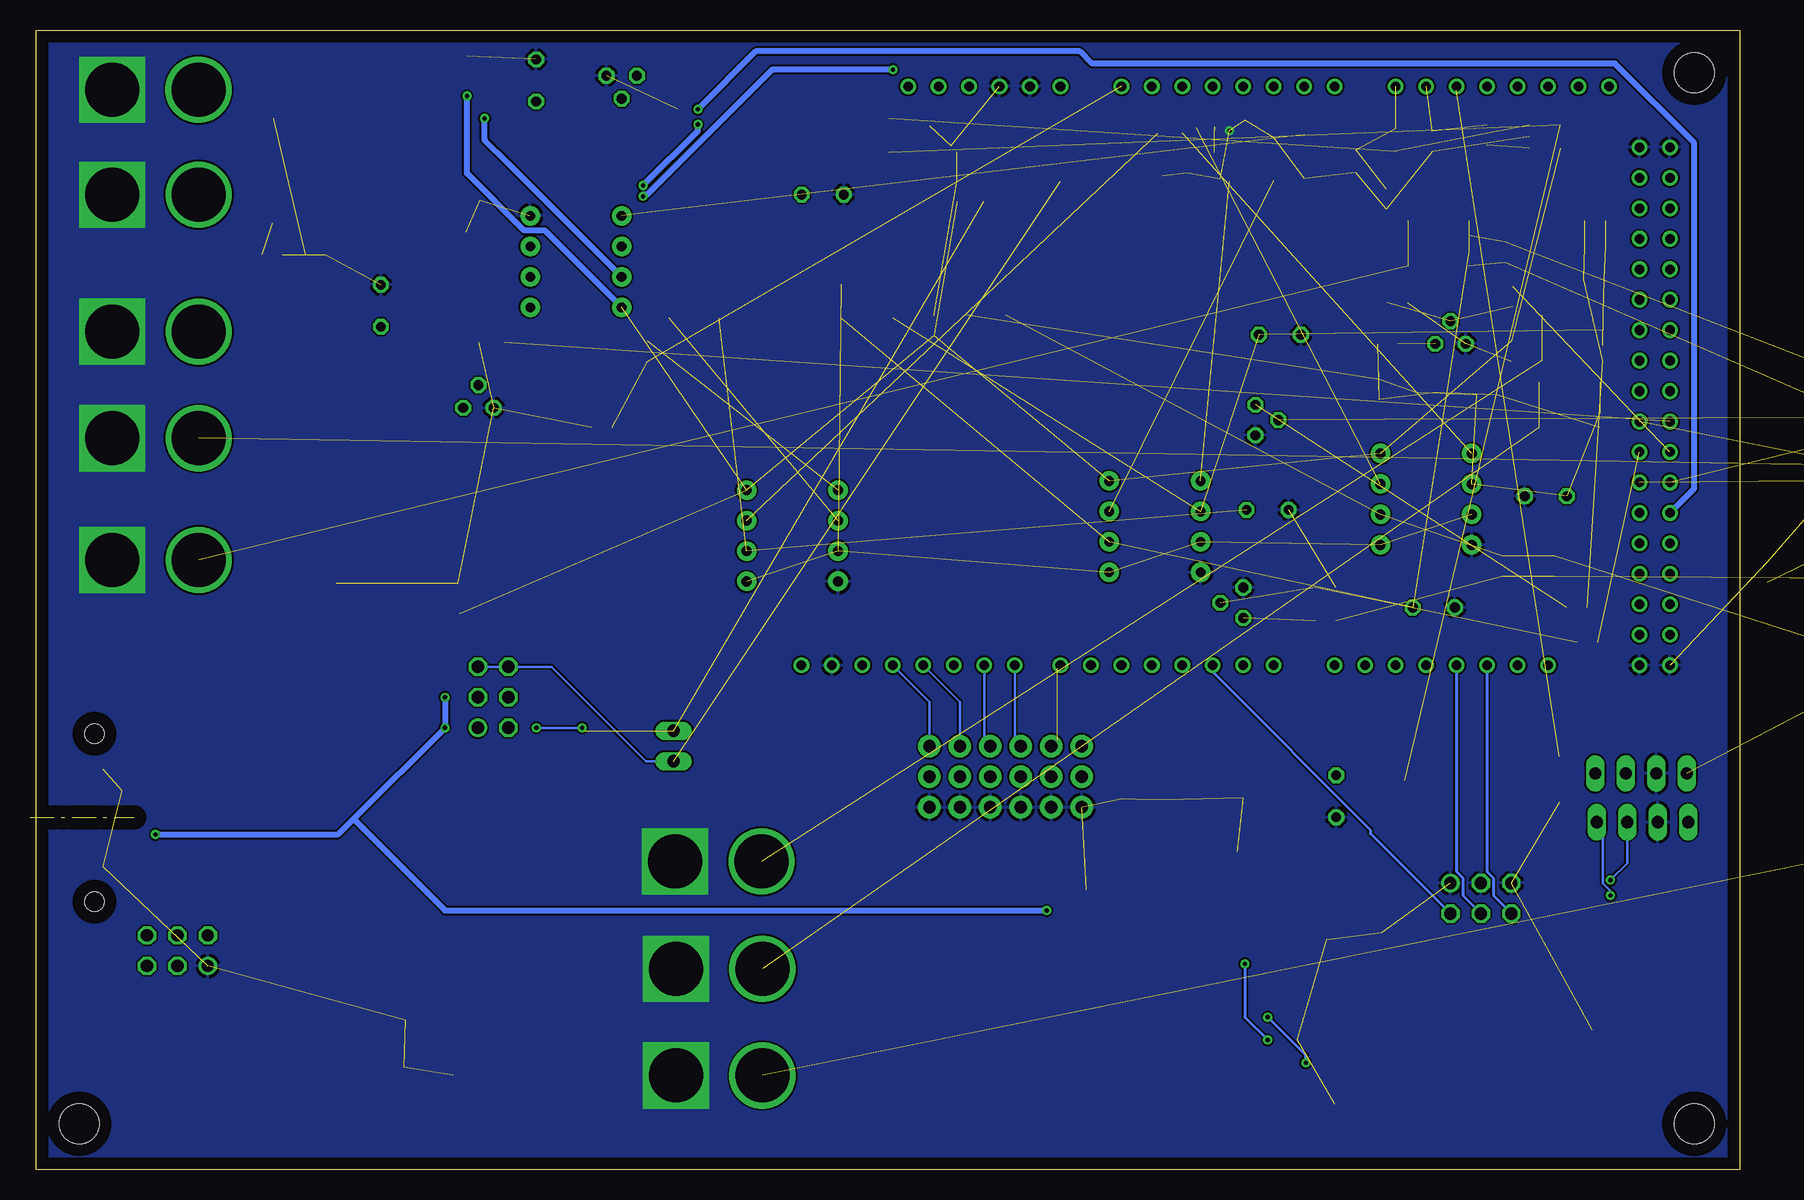
[diagram p5: board, bottom side, seen from below]

Size 142 x 95 mm. Coordinates in mm from the lower left corner, seen from the top.
Outline: 0,0 142,0 142,95 0,95 0,0
Copper layers (1*16): Top 0.035mm / dielectric 1.5mm / Bottom 0.035mm
Design rules "default": minimum track width 6mil, minimum drill 0.35mm, track to track 6mil, track to pad 6mil, pad to pad 6mil, via to via 6mil, smd to smd 6mil, copper to edge 40mil, drill to drill 6mil, minimum pad ring 10mil, minimum via ring 8mil, stop-mask expansion 4mil, vias tented up to drill 0mil, thermal gap 10mil
Holes 3.3 mm at 3.81,3.81 138.43,3.81 3.81,91.44

### Footprints (pad centres in the part's own frame; a part is rotated, then mirrored left to right if it is on the bottom)
MEGAOUTLINE = drill 0.8: 0 12.7,24.13; 1 10.16,24.13; 2 7.62,24.13; 3 5.08,24.13; 3V3 -15.24,-24.13; 4 2.54,24.13; 5 0,24.13; 5V -12.7,-24.13; 6 -2.54,24.13; 7 -5.08,24.13; 8 -8.89,24.13; 9 -11.43,24.13; 10 -13.97,24.13; 11 -16.51,24.13; 12 -19.05,24.13; 13 -21.59,24.13; 14 17.78,24.13; 15 20.32,24.13; 16 22.86,24.13; 17 25.4,24.13; 18 27.94,24.13; 19 30.48,24.13; 20 33.02,24.13; 21 35.56,24.13; 22 43.18,21.59; 23 45.72,21.59; 24 43.18,19.05; 25 45.72,19.05; 26 43.18,16.51; 27 45.72,16.51; 28 43.18,13.97; 29 45.72,13.97; 30 43.18,11.43; 31 45.72,11.43; 32 43.18,8.89; 33 45.72,8.89; 34 43.18,6.35; 35 45.72,6.35; 36 43.18,3.81; 37 45.72,3.81; 38 43.18,1.27; 39 45.72,1.27; 40 43.18,-1.27; 41 45.72,-1.27; 42 43.18,-3.81; 43 45.72,-3.81; 44 43.18,-6.35; 45 45.72,-6.35; 46 43.18,-8.89; 47 45.72,-8.89; 48 43.18,-11.43; 49 45.72,-11.43; 50 43.18,-13.97; 51 45.72,-13.97; 52 43.18,-16.51; 53 45.72,-16.51; A0 0,-24.13; A1 2.54,-24.13; A2 5.08,-24.13; A3 7.62,-24.13; A4 10.16,-24.13; A5 12.7,-24.13; A6 15.24,-24.13; A7 17.78,-24.13; A8 22.86,-24.13; A9 25.4,-24.13; A10 27.94,-24.13; A11 30.48,-24.13; A12 33.02,-24.13; A13 35.56,-24.13; A14 38.1,-24.13; A15 40.64,-24.13; AREF -26.67,24.13; GND@1 -24.13,24.13; GND@2 -10.16,-24.13; GND@3 -7.62,-24.13; GND@4 43.18,24.13; GND@5 45.72,24.13; GND@6 43.18,-19.05; GND@7 45.72,-19.05; RESET -17.78,-24.13; VIN -5.08,-24.13
C0603 = smd 1.1 x 1: 1 -0.85,0; 2 0.85,0
3.5MMCAP = drill 0.813 octagon: 1 -1.75,0; 2 1.75,0
C0805 = smd 1.3 x 1.5: 1 -0.85,0; 2 0.85,0
0603 = smd 1.1 x 1: 1 -0.85,0; 2 0.85,0
C1206 = smd 1.6 x 1.8: 1 -1.4,0; 2 1.4,0
SOD523-M = smd 0.605 x 0.452: 1 -0.852,0; 2 0.852,0
SMASERIES-M = smd 2.565 x 1.651: 1 -1.613,0; 2 1.613,0
DPAK229P990X238-3N = smd 0.97 x 2.83: 1 -2.29,-4.14; 3 2.29,-4.14 | smd 5.63 x 6.09: 4 0,2.51
BOURNS-INC.---SMAJ15A_BOURNS_INC._SMAJ15A_0 = smd 1.27 x 2.1: 1 -1.985,0; 2 1.985,0
DIOM7958X256N = smd 2 x 3.05: 1 -3.6,0; 2 3.6,0
SOD2512X110N = smd 1.03 x 0.52: A 1.15,0; C -1.15,0
FUSM1812X02 = smd 1.9 x 3.4: 1 -1.95,0; 2 1.95,0
DIP08 = drill 0.813 pad 1.626: 1 -3.81,-3.81; 2 -1.27,-3.81; 3 1.27,-3.81; 4 3.81,-3.81; 5 3.81,3.81; 6 1.27,3.81; 7 -1.27,3.81; 8 -3.81,3.81
SOIC127P600X175-8N = smd 1.525 x 0.7: 1 -2.712,1.905; 2 -2.712,0.635; 3 -2.712,-0.635; 4 -2.712,-1.905; 5 2.712,-1.905; 6 2.712,-0.635; 7 2.712,0.635; 8 2.712,1.905
AMASS_XT60-M = drill 4.5 square: 1 -3.6,0 | drill 4.5: 2 3.6,0
JST04_1MM_VERT = smd 0.6 x 1.55: 1 -1.478,0.775; 2 -0.478,0.775; 3 0.522,0.775; 4 1.522,0.775 | smd 1.2 x 2: NC1 -2.778,3.2; NC2 2.822,3.2
CUI_UJ2-MIBH-2-SMT-TR-67 = smd 0.4 x 0.95: 1 -1.3,3.925; 2 -0.65,3.925; 3 0,3.925; 4 0.65,3.925; 5 1.3,3.925 | smd 1.2 x 2.2: S1 -4.05,2.45; S2 4.05,2.45 | smd 0.8 x 1: S3 2.25,4.05 | hole 1.6: -7,1.775; 7,1.775
1X06 = drill 1.016 pad 1.88: 1 0,0; 2 2.54,0; 3 5.08,0; 4 7.62,0; 5 10.16,0; 6 12.7,0
IND_BOURNS_SRR1240 = smd 2.896 x 5.41: 1 -4.851,0; 2 4.851,0
XFL4020 = smd 0.98 x 3.4: P$1 1,1.8; P$2 3.4,1.8
CHIPLED_0805 = smd 1.2 x 1.2: A 0,-1.05; C 0,1.05
SOP254P1016X460-4N = smd 2.1 x 1.45: 1 -4.55,1.27; 2 -4.55,-1.27; 3 4.55,-1.27; 4 4.55,1.27
SOT323 = smd 0.7 x 0.7: 1 -0.65,-0.925; 2 0.65,-0.925; 3 0,0.925
SO-8 = smd 0.6 x 1.2: 1 -1.905,-2.527; 2 -0.635,-2.527; 3 0.635,-2.527; 4 1.905,-2.527; 5 1.905,2.527; 6 0.635,2.527; 7 -0.635,2.527; 8 -1.905,2.527
M0805 = smd 1.3 x 1.6: 1 -0.95,0; 2 0.95,0
R0805 = smd 1.1 x 1.4: 1 -1,0; 2 1,0
R0603 = smd 1 x 1.1: 1 -0.85,0; 2 0.85,0
R1206 = smd 1.6 x 1.803: 1 -1.422,0; 2 1.422,0
R2512 = smd 1.8 x 3.2: 1 -2.8,0; 2 2.8,0
MA03-2 = drill 1.016: 1 -2.54,-1.27 | drill 1.016 octagon: 2 -2.54,1.27; 3 0,-1.27; 4 0,1.27; 5 2.54,-1.27; 6 2.54,1.27
MA04-1 = drill 1.016 long: 1 -3.81,0; 2 -1.27,0; 3 1.27,0; 4 3.81,0
TO92 = drill 0.813 octagon: 1 1.27,0; 2 0,1.905; 3 -1.27,0
1X02 = drill 1.016 long: 1 -1.27,0; 2 1.27,0
M08A = smd 1.981 x 0.559: 1 -2.464,1.905; 2 -2.464,0.635; 3 -2.464,-0.635; 4 -2.464,-1.905; 5 2.464,-1.905; 6 2.464,-0.635; 7 2.464,0.635; 8 2.464,1.905
DCY4 = smd 0.889 x 1.765: 1 -2.311,-3.118; 2 0,-3.118; 3 2.311,-3.118 | smd 3.15 x 1.765: 4 0,3.118
SO-8_S = smd 1.981 x 0.533: 1 -2.464,1.905; 2 -2.464,0.635; 3 -2.464,-0.635; 4 -2.464,-1.905; 5 2.464,-1.905; 6 2.464,-0.635; 7 2.464,0.635; 8 2.464,1.905
TENDA = drill 1.016: 1 -13.03,13.335; 7 9.477,-6.522 | drill 1.016 octagon: 2 -15.57,13.335; 3 -13.03,15.875; 4 -15.57,15.875; 5 -13.03,18.415; 6 -15.57,18.415; 8 9.477,-3.982; 9 12.017,-6.522; 10 12.017,-3.982; 11 14.557,-6.522; 12 14.557,-3.982
SOT23-5 = smd 0.55 x 1.2: 1 -0.95,-1.3; 2 0,-1.3; 3 0.95,-1.3; 4 0.95,1.3; 5 -0.95,1.3

### Placement (x,y rotation side)
$2_3_$_2020-06-04_21-52-10  51.56,66.17 180 top
C1  67.18,70.36 90 top
C2  -45.59,59.56 0 top  (outside the outline)
C3  41.27,86.61 90 top
C4  94.87,61.85 0 top
C5  38.86,86.87 270 top
C6  48.13,83.69 270 top
C7  25.52,46.85 180 top
C8  39.37,54.99 180 top
C9  38.35,69.6 180 top
C10  113.28,72.01 90 top
C11  65.28,81.53 90 top
C12  19.05,68.2 270 top
C13  25.65,85.72 270 top
C14  46.1,83.95 270 top
C15  43.31,83.44 270 top
C16  -20.57,40.13 180 top  (outside the outline)
C17  33.66,31.11 270 top
C18  16.18,56.13 0 top
C19  110.36,12.45 0 top
C20  29.46,80.9 270 top
C21  118.75,76.26 180 top
C22  122.36,76.26 180 top
C23  106.12,91.94 90 top
C24  36.32,83.44 270 top
C25  106.18,77.28 90 top
C26  110.49,8.51 0 top
C27  76.45,81.28 180 top
C28  100.35,90.79 90 top
C29  34.42,17.78 90 top
C30  56.64,81.53 90 top
C31  33.78,6.86 270 top
C32  40.22,6.59 180 top
C33  67.56,87.88 270 top
C34  54.48,22.48 90 top
C35  12.19,74.18 0 top
C36  101.59,82.92 270 top
C37  -51.18,52.32 0 top  (outside the outline)
C38  15.49,50.29 270 top
C39  108.46,66.29 270 top
C40  30.07,65.02 270 top
C41  19.56,76.45 270 top
CR1  81.79,89.03 90 top
CR2  12.06,79.12 0 top
CR3  105.03,82.42 270 top
CR4  96.52,83.06 270 top
CR5  -21.84,76.33 270 top  (outside the outline)
CR6  -23.88,50.04 270 top  (outside the outline)
CR7  111,66.29 270 top
CR8  26.18,64.78 180 top
CR9  -23.11,60.71 270 top  (outside the outline)
D1  118.11,89.92 90 top
D2  118.11,81.28 90 top
D3  29.84,17.78 90 top
D4  41.91,22.86 90 top
D5  42.93,8.38 0 top
F1  27.94,30.48 270 top
IC1  97.03,75.69 270 top
IC2  87.63,82.55 270 top
IC3  78.99,52.83 270 top
IC4  26.16,55.88 270 top
IC5  48.77,53.59 270 top
IC8  76.45,88.27 180 top
J1  132.09,90.02 180 top
J2  132.08,81.28 180 top
J3  10.82,12.41 180 top
J4  138.94,29.34 90 top
J5  132.08,69.85 180 top
J6  85.17,25.69 180 top
J7  132.08,50.8 180 top
J8  85.09,16.73 180 top
J9  132.08,60.96 180 top
J10  85.09,7.84 180 top
J11  54.87,30.21 0 top
J12  54.87,32.75 0 top
J13  67.57,35.29 180 top
L1  52.26,12.79 90 top
L2  64.01,82.55 180 top
LED1  110.87,48.9 270 top
LED2  100.71,48.9 270 top
LED3  115.95,48.9 270 top
LED4  105.79,48.9 270 top
LED5  49.02,31.86 180 top
LED6  41.39,32.01 180 top
LED7  46.45,31.91 180 top
LED8  51.52,31.94 180 top
Q1  60.71,86.11 0 top
Q2  8.59,20.72 0 top
Q4  -28.45,31.5 270 top  (outside the outline)
Q6  14.22,63.75 270 top
Q8  25.15,77.22 270 top
Q10  119.23,67.92 270 top
Q12  -45.47,56.26 270 top  (outside the outline)
Q14  13.97,69.34 270 top
Q16  12.13,20.66 0 top
R1  19.81,11.18 0 top
R2  21.59,14.22 270 top
R3  110.87,46.35 180 top
R4  23.24,11.18 180 top
R5  100.71,46.35 0 top
R6  115.95,46.35 180 top
R7  41.27,82.8 90 top
R8  91.06,68.2 90 top
R9  38.86,83.31 270 top
R10  48.51,87.25 270 top
R11  74.93,72.39 270 top
R12  85.09,72.39 270 top
R13  70.61,72.39 270 top
R14  89.41,72.39 270 top
R15  21.08,86.23 270 top
R16  46.48,87.25 270 top
R17  43.81,87.5 90 top
R18  61.21,72.64 270 top
R19  70.92,86.21 270 top
R20  64.52,72.64 270 top
R21  32,84.07 90 top
R22  28.7,85.85 270 top
R23  36.32,87.12 270 top
R24  104.01,77.28 90 top
R26  109.93,89.6 270 top
R27  105.79,46.35 0 top
R28  53.34,86.87 270 top
R29  81.53,92.33 0 top
R30  76.83,92.33 180 top
R31  12.06,76.96 180 top
R32  -23.37,63.61 270 top  (outside the outline)
R33  -25.65,62.63 90 top  (outside the outline)
R34  13.59,46.86 180 top
R35  99.47,82.93 90 top
R36  87.88,90.17 0 top
R37  89.41,88.39 0 top
R38  87.88,92.2 180 top
R39  -49.78,54.99 90 top  (outside the outline)
R40  -50.47,49.77 270 top  (outside the outline)
R41  -9.61,58.19 270 top  (outside the outline)
R42  -43.69,49.4 90 top  (outside the outline)
R43  19.81,50.29 90 top
R44  12.7,43.94 0 top
R45  34.54,48.51 0 top
R46  34.54,45.72 180 top
R47  114.43,66.29 90 top
R48  103.01,68.1 270 top
R49  105.15,68.08 270 top
R50  112.27,63.5 0 top
R51  21.08,64.56 0 top
R52  18.92,72.77 270 top
R53  28.57,72.26 0 top
R54  29.35,68.83 0 top
R55  -21.08,60.71 90 top  (outside the outline)
R56  -16.51,56.64 270 top  (outside the outline)
R57  -2.29,49.78 270 top
R58  -16.13,59.69 180 top  (outside the outline)
R59  8.41,23.95 0 top
R60  12.93,16.9 0 top
R61  8.3,16.86 0 top
R62  13.08,23.98 180 top
R63  41.4,38.08 270 top
R64  46.43,38.08 270 top
R65  49.01,38.13 270 top
R66  51.53,38.16 270 top
R67  109.94,81.36 90 top
SV4  21.59,22.61 180 top
SV6  8.26,33.02 180 top
SV8  8.13,28.96 180 top
T1  93.22,91.19 180 top
T2  41.4,47.24 270 top
T3  24.13,68.83 0 top
T4  40.39,62.48 90 top
T5  -22.86,49.78 0 top  (outside the outline)
T6  105.16,63.5 0 top
T7  -48.26,45.47 0 top  (outside the outline)
TETHER  88.9,35.31 270 top
U1  17.53,32.51 0 top
U7  104.14,10.16 90 top
U8  39.37,12.7 0 top
U$1  118.24,23.5 0 top
U$2  16.26,86.11 90 top

### Tracks (layer width: path | path; a pad name or v marks a point on that pad's centre or on a via)
3.3V
  Top 0.203: R61.1 7.28,16.89 7.28,19.14 Q2.1 8.69,19.05 10.79,19.05 Q16.1 11.93,19.29 R60.1
5V  (via drill 0.35)  (9 unrouted)
  Top 0.203: R4.2 R1.2 | 107.95,13.16 U7.3 107.28,12.45 | 4.45,29.08 SV8.4
  Top 0.254: 34.61,12.06 34.54,12.13 | U8.3 37.63,11.34 38.01,11.34 38.18,11.18 38.18,10.41 38.1,10.34 38.1,5.71 38.73,5.08 42.55,5.08 44.45,6.99 44.45,7.62
  Top 0.508: R27.2 107.95,45.15 v107.95,39.37 | v107.95,36.83 107.95,13.16 | SV6.4 4.45,29.08 | C19.1 107.28,12.45 | J4.1 132.18,28.04 v132.08,27.94 | SV8.4 7.73,25.55 16.51,25.55 16.51,31.74 19.11,34.34 19.91,34.34 U1.8 20.82,34.42 21.67,33.57 21.67,25.77 20.35,24.45 20.35,13.68 20.75,13.27 R2.2 22.29,12.57 R4.2 22.29,10.75 23.19,9.85 25.14,9.85 27.43,12.13 34.54,12.13 | U8.3 34.61,12.06 | v106.11,89.5 C23.1
  Bottom 0.508: v107.95,39.37 v107.95,36.83 115.57,29.21 | v132.08,27.94 116.84,27.94 115.57,29.21 | 115.57,29.21 107.95,21.59 v57.78,21.59 | IC1.4 99.62,78.28 101.34,78.28 106.11,83.05 v106.11,89.5
  pour Top (no thermals): 40.64,11.43 40.64,9.53 43.81,9.53 43.81,6.35 60.96,6.35 63.5,8.89 63.5,22.23 46.35,22.23 46.35,19.68 58.71,19.68 58.71,11.43
+3V3
  Top 0.203: LED2.A 99.66,47.91 98.91,47.16 98.91,12.28 U7.4 | U$1.11 U$1.12 | C26.1 108.91,8.51 U7.2
  Top 0.508: U$1.11 125.98,10.16 U7.2 U7.4 101.02,7.68 96.52,3.17 17.46,3.17 11.6,9.04 11.6,11.34 J3.2
+5V
  Top 0.203: R62.1 13.69,23.98 12.74,24.93 8.39,24.93 R59.1
BATT_VOLTAGE  (3 unrouted)
BTMP  (1 unrouted)
  Bottom 0.203: 23.62,90 $2_3_$_2020-06-04_21-52-10.A10
COMBINED_POWER
  Top 0.152: IC2.3 87,84.45
  Top 0.508: IC1.2 98.04,76.96 100.58,74.42 IC1.6 101.35,74.93 107.07,74.93 107.44,75.3 107.44,83.82 | 99.6,83.65 R35.2 | 105.14,84.43 105.03,84.31 CR3.1 | C28.1 100.35,85.62 100.33,85.6 | R29.2 84.07,90.74 84.07,83.31
  Top 2.54: 109.93,84.43 R26.2 | 109.93,84.17 R67.2
  pour Top: 108.2,87.88 111.76,87.88 111.76,83.06
  pour Top (no thermals): 107.95,88.14 112.01,88.14 112.01,82.8 79.25,82.8 79.25,80.77 78.74,80.26 77.72,80.26 77.22,80.77 77.22,81.79 77.72,82.3 78.23,82.3 78.23,89.41 80.11,89.41 80.11,88.54 82.3,88.54 82.3,84.07 86.36,84.07 86.36,86.36 106.17,86.36
CTLD_ELEC_PWR  (2 unrouted)
  Top 0.406: R19.1 IC8.7
  pour Top (no thermals): 72.9,90.68 72.9,85.85 74.68,85.85 74.68,90.68
ELEC_CURR  (2 unrouted)
ESC_MAIN_POWER_SW  (via drill 0.35)
  Top 0.508: R36.1 87.03,88.56 v86.87,88.39
  Bottom 0.508: v86.87,88.39 82.04,93.22 55.02,93.22 54,92.2 10.41,92.2 3.81,85.6 3.81,56.77 $2_3_$_2020-06-04_21-52-10.31
ESC_PA_POWER  (8 unrouted)
ESC_PF_POWER  (8 unrouted)
ESC_POWER  (6 unrouted)
  Top 0.203: 85.24,73.66 R12.1 85.09,73.03
  pour Top (no thermals): 90.68,80.52 90.68,73.03 59.94,73.03 59.94,76.71 81.42,76.71 85.23,80.52
ESC_POWER1  (via drill 0.35)
  Top 0.508: 109.16,92.4 R26.1 | v104.65,87.63 106.43,87.63 109.93,91.13 109.93,91.89
  Top 2.032: 109.67,92.15 109.93,91.89 | 109.93,91.89 109.93,89.78 115.46,89.78 D1.4 | 109.93,91.89 R26.1
  Bottom 0.508: IC1.3 102.62,83.82 104.62,85.83 104.65,85.85 v104.65,87.63
ESC_POWER2
  Top 0.508: IC1.5 103.12,74.17 107.58,74.17 108.16,74.75 108.16,77.29 109.43,78.56 R67.1
  Top 2.032: R67.1 109.94,81.24 109.98,81.28 D2.4
ESC_PV_POWER  (1 unrouted)
  Top 0.203: C39.1 CR7.1 R47.2 114.68,67.4 116.59,67.4 Q10.3 | 89.26,70.97 R14.2
  Top 0.508: 111,70.18 CR7.1 | R14.2 90.19,70.18 111,70.18 | C10.1 113.21,70.18 111,70.18
  Top 1.27: Q10.2 Q10.3
  Top 2.032: Q10.1 Q10.2
ESC_SA_POWER  (8 unrouted)
ESC_SF_POWER  (8 unrouted)
ESC_SV_POWER  (5 unrouted)
ESCPA_CURR
  Top 0.203: $2_3_$_2020-06-04_21-52-10.A4 40.27,89.17 40.27,88.9 40.27,86.71 40.42,86.56 40.48,86.56 C3.1 41.27,85.06 40.47,84.26 40.47,82.76 R7.1
ESCPA_POWER  (4 unrouted)
ESCPA_PWM
  Bottom 0.203: J13.1 67.57,38.99 $2_3_$_2020-06-04_21-52-10.12
ESCPA_SWITCH  (1 unrouted)
ESCPF_CURR
  Top 0.203: $2_3_$_2020-06-04_21-52-10.A2 R16.1 45.68,87.3 45.68,85.79 46.1,85.37 C14.1
ESCPF_POWER  (4 unrouted)
ESCPF_PWM
  Bottom 0.203: J13.4 60.45,35.79 $2_3_$_2020-06-04_21-52-10.8
ESCPF_SWITCH  (1 unrouted)
ESCPV_CURR  (2 unrouted)
ESCPV_POWER
  Top 2.032: Q10.5 Q10.6 Q10.7 Q10.8 121.79,69.85 J5.2
ESCPV_PWM
  Top 0.203: J13.6 54.87,41.27 $2_3_$_2020-06-04_21-52-10.6
ESCPV_SWITCH  (1 unrouted)
ESCSA_CURR
  Top 0.203: R9.1 38.86,84.26 37.86,85.26 37.86,86.77 38.01,86.92 38.07,86.92 C5.1 $2_3_$_2020-06-04_21-52-10.A5
ESCSA_POWER  (4 unrouted)
ESCSA_PWM
  Bottom 0.203: J13.3 62.99,35.79 $2_3_$_2020-06-04_21-52-10.9
ESCSA_SWITCH  (1 unrouted)
ESCSF_CURR  (2 unrouted)
  Top 0.203: 43.81,86.94 43.01,87.75 43.01,89.37 $2_3_$_2020-06-04_21-52-10.A3 | C15.1 43.81,84.8
ESCSF_POWER  (4 unrouted)
ESCSF_PWM
  Bottom 0.203: J13.2 65.03,38.99 $2_3_$_2020-06-04_21-52-10.11
ESCSF_SWITCH  (1 unrouted)
ESCSV_CURR
  Top 0.203: $2_3_$_2020-06-04_21-52-10.A1 48.51,89.79 R10.1 47.71,87.3 47.71,85.79 48.13,85.37 C6.1
ESCSV_POWER  (4 unrouted)
ESCSV_PWM  (1 unrouted)
  Top 0.203: J13.5 56.9,35.79 | 56.9,41.78 $2_3_$_2020-06-04_21-52-10.7
ESCSV_SWITCH  (1 unrouted)
GND  (via drill 0.35)  (53 unrouted)
  Top 0.203: Q1.3 65.76,85.34 65.79,85.34
  other vias: 42.55,86.61
  pour Bottom: 0,95.25 142.24,95.25 142.24,0 0,0
IN-2  (2 unrouted)
LK_DET_MAIN
  Top 0.203: R1.1 18.86,21.15 SV4.6
  Bottom 0.254: $2_3_$_2020-06-04_21-52-10.19 21.08,24.84 20.55,24.31 20.55,22.84 SV4.6
LK_DET_P_BAT
  Top 0.203: SV4.4 R2.1
  Bottom 0.254: $2_3_$_2020-06-04_21-52-10.18 23.62,24.84 23.09,24.31 23.09,22.84 SV4.4
LK_DET_S_BAT
  Top 0.203: SV4.2 24.19,21.27 R4.1
  Bottom 0.254: SV4.2 30.81,28.02 30.81,28.33 43.94,41.46 $2_3_$_2020-06-04_21-52-10.2
N$2  (1 unrouted)
N$3  (via drill 0.35)
  Top 0.254: C32.2 39.37,9.37 v39.37,10.79
  Bottom 0.254: v41.27,17.14 41.27,12.7 v39.37,10.79
  pour Top (no thermals): 39.37,21.59 44.45,21.59 44.45,19.05 52.07,19.05 52.07,13.97 39.37,13.97
N$4  (via drill 0.35)
  Top 0.254: C31.1 34.41,8.89 v36.2,8.89 | v39.37,12.7 40.01,12.06 U8.6
  Bottom 0.254: v36.2,8.89 36.2,9.53 v39.37,12.7
N$6  (via drill 0.35)
  Top 0.152: C36.2
  Top 0.508: C36.2 R35.1 99.34,82.21 CR4.2 96.36,82.04 v91.44,82.04 | R38.2 85.72,90.89 85.72,87.12 | 85.72,87.12 IC2.4 | v86.87,87.12 85.72,87.12
  Bottom 0.508: v91.44,82.04 86.87,86.61 v86.87,87.12
N$7  (1 unrouted)
  Top 0.203: R17.2 45.32,86.85
N$8
  Top 0.203: $2_3_$_2020-06-04_21-52-10.3 46.48,39.09 R64.1
N$9  (1 unrouted)
  Top 0.203: R7.2 42.55,82.38
N$10  (2 unrouted)
N$11  (1 unrouted)
N$12  (4 unrouted)
N$13  (4 unrouted)
N$14
  Top 0.203: $2_3_$_2020-06-04_21-52-10.4 49.02,39.09 R65.1
N$15
  Top 0.508: R38.1 90.93,92.2 T1.1
N$16
  Top 0.203: R28.1 55.71,87.82 Q1.1
N$17
  Top 0.508: R37.2 90.18,88.39 | R37.2 90.26,88.65 R36.2 | R37.2 91.15,89.28 T1.2
N$18  (1 unrouted)
N$19  (4 unrouted)
N$20  (2 unrouted)
N$21  (1 unrouted)
N$22
  Top 0.203: R47.1 114.43,63.92 114.01,63.5 R50.2 | C39.2 CR7.2 R47.1 | R47.1 116.14,65.44 Q10.4
N$23
  Top 0.508: R49.2 | R49.2 T6.2 | R48.2 103.03,67.23 R49.2
N$24
  Top 0.508: T6.1 R50.1
N$25  (4 unrouted)
N$26  (2 unrouted)
N$27  (1 unrouted)
N$28
  Top 0.203: $2_3_$_2020-06-04_21-52-10.5 51.56,39.14 R66.1
N$29  (2 unrouted)
N$30  (1 unrouted)
N$31  (4 unrouted)
N$32  (2 unrouted)
N$33  (1 unrouted)
N$34  (1 unrouted)
  Top 0.203: R23.2 35.56,85.51
N$35
  Top 0.508: R24.2 102,78.13 IC1.7
N$36  (1 unrouted)
N$37
  Top 2.032: D3.1 26.67,18.97 26.67,27.26 F1.2
  pour Top (no thermals): 38.73,13.97 28.57,13.97 28.57,17.14 38.73,17.14
N$38
  Top 0.254: C32.1 41.78,7.3 D5.C 40.03,10.13 40.03,11.07 38.48,12.61 37.63,12.61 U8.2
N$39
  Top 0.203: R27.1 104.84,48.8 LED4.A
N$40
  Top 0.203: $2_3_$_2020-06-04_21-52-10.1 R63.1
N$41
  Top 0.203: R63.2 41.41,33.07 LED6.A
N$42
  Top 0.203: R64.2 46.43,32.98 LED7.A
N$43
  Top 0.203: CR1.2 81.5,90.17 IC8.4 79.17,92.28 79.12,92.33 | R30.1 79.12,92.33 | 79.12,92.33 R29.1
N$44
  Top 0.203: R30.2 72.66,92.33 69.06,88.73 C33.1 67.31,88.48 65.26,88.48 Q1.4
N$45
  Top 0.203: R65.2 LED5.A
N$46
  Top 0.203: R66.2 LED8.A
N$48
  Top 0.203: R28.2 53.34,82 54.65,80.68 C30.1 56.71,80.75 L2.P$2
N$53
  Top 0.203: R3.1 130.25,27.97 U$1.10
N$54
  Top 0.203: LED2.C 101.76,46.41 R5.2
N$55
  Top 0.203: U$1.8 126.55,19.51 105.17,40.89 104.79,40.89 104.19,41.49 104.19,41.88 R5.1
N$56
  Top 0.203: LED1.A 109.87,48.84 R3.2
N$57
  Top 0.203: U$1.9 130.25,18.08 131.27,19.09 131.27,32.04 R6.1
N$58
  Top 0.203: LED3.A 114.9,46.41 R6.2
O  (1 unrouted)
O2  (1 unrouted)
P_BATT+  (1 unrouted)
  pour Top (no thermals): 120.4,93.22 120.4,86.61 131.83,86.61 131.83,93.22
PORT_BAT_CURR
  Top 0.203: $2_3_$_2020-06-04_21-52-10.A6 R23.1 36.32,87.68 37.13,86.88 37.13,85.67 36.32,84.86 C24.1
S_BATT+  (1 unrouted)
  Top 0.508: 122.34,78.9 D2.1
  pour Top (no thermals): 120.4,84.58 120.4,77.98 131.83,77.98 131.83,84.58
SCL  (via drill 0.35)
  Top 0.203: $2_3_$_2020-06-04_21-52-10.21 9.53,35.56 SV6.2 9.53,29.08 SV8.2 | Q2.3 8.59,23.14 R59.2 9.58,24.13 v10.79,24.13
  Bottom 0.203: v10.79,24.13 9.4,25.53 SV8.2
SCL_3V3
  Top 0.203: Q2.2 9,19.8 8.39,20.4 7.48,20.4 6.5,19.42 6.5,16.06 6.65,15.91 7.96,15.91 8.91,16.86 R61.2 J3.4
SDA  (via drill 0.35)
  Top 0.203: $2_3_$_2020-06-04_21-52-10.20 12.06,35.56 SV6.1 11.94,32.89 SV8.1 | Q16.3 12.08,21.63 R62.2 10.96,22.86 v10.79,22.86
  Bottom 0.203: v10.79,22.86 10.79,23.24 11.43,23.87 11.43,28.45 SV8.1
SDA_3V3
  Top 0.203: Q16.2 12.78,19.6 13.97,18.41 13.97,16.94 R60.2 10.3,13.27 J3.3
STBD_BAT_CURR  (via drill 0.35)
  Top 0.508: C25.1 R24.1 102.23,76.43 101.55,75.74 100.33,75.74 94.94,81.13 v91.44,81.13 | $2_3_$_2020-06-04_21-52-10.A7 35.18,91.69 v70.61,91.69
  Bottom 0.508: v91.44,81.13 91.32,81.26 91.11,81.26 80.68,91.69 v70.61,91.69
TETHER_A  (via drill 0.35)  (2 unrouted)
  Top 0.203: U$1.1 U$1.2 v100.33,36.83 | v96.52,36.83 96.27,36.58
  Bottom 0.203: v100.33,36.83 v96.52,36.83
TETHER_B  (1 unrouted)
  Top 0.203: Q1.2 56.16,82.87 C30.2
  Bottom 0.203: U$1.5 U$1.6 99.06,41.91 91.19,34.04 TETHER.2
TRONICS_POWER  (2 unrouted)
  Top 2.032: C17.1 32.43,32.43 F1.1

### Text on the board
tPlace: Port Bat / /\\(*_*)/\\ | Starboard / Bat | ESC | PV | ESC | SV | ENET | PWR | Tenda / Current | Tenda / Power | ESC | SA | PV | SV | PF | SA | SF | PA | A | 1 | 3 | 4 | 5 | PWM | NC | B | Tether | GND | Status | ESC | Port Aft | ESC | Port Forward | ESC | Starboard Forward